# EAGLE board Stovetop-v3.0_Release (EAGLE 9.5.2), part 1 of 2
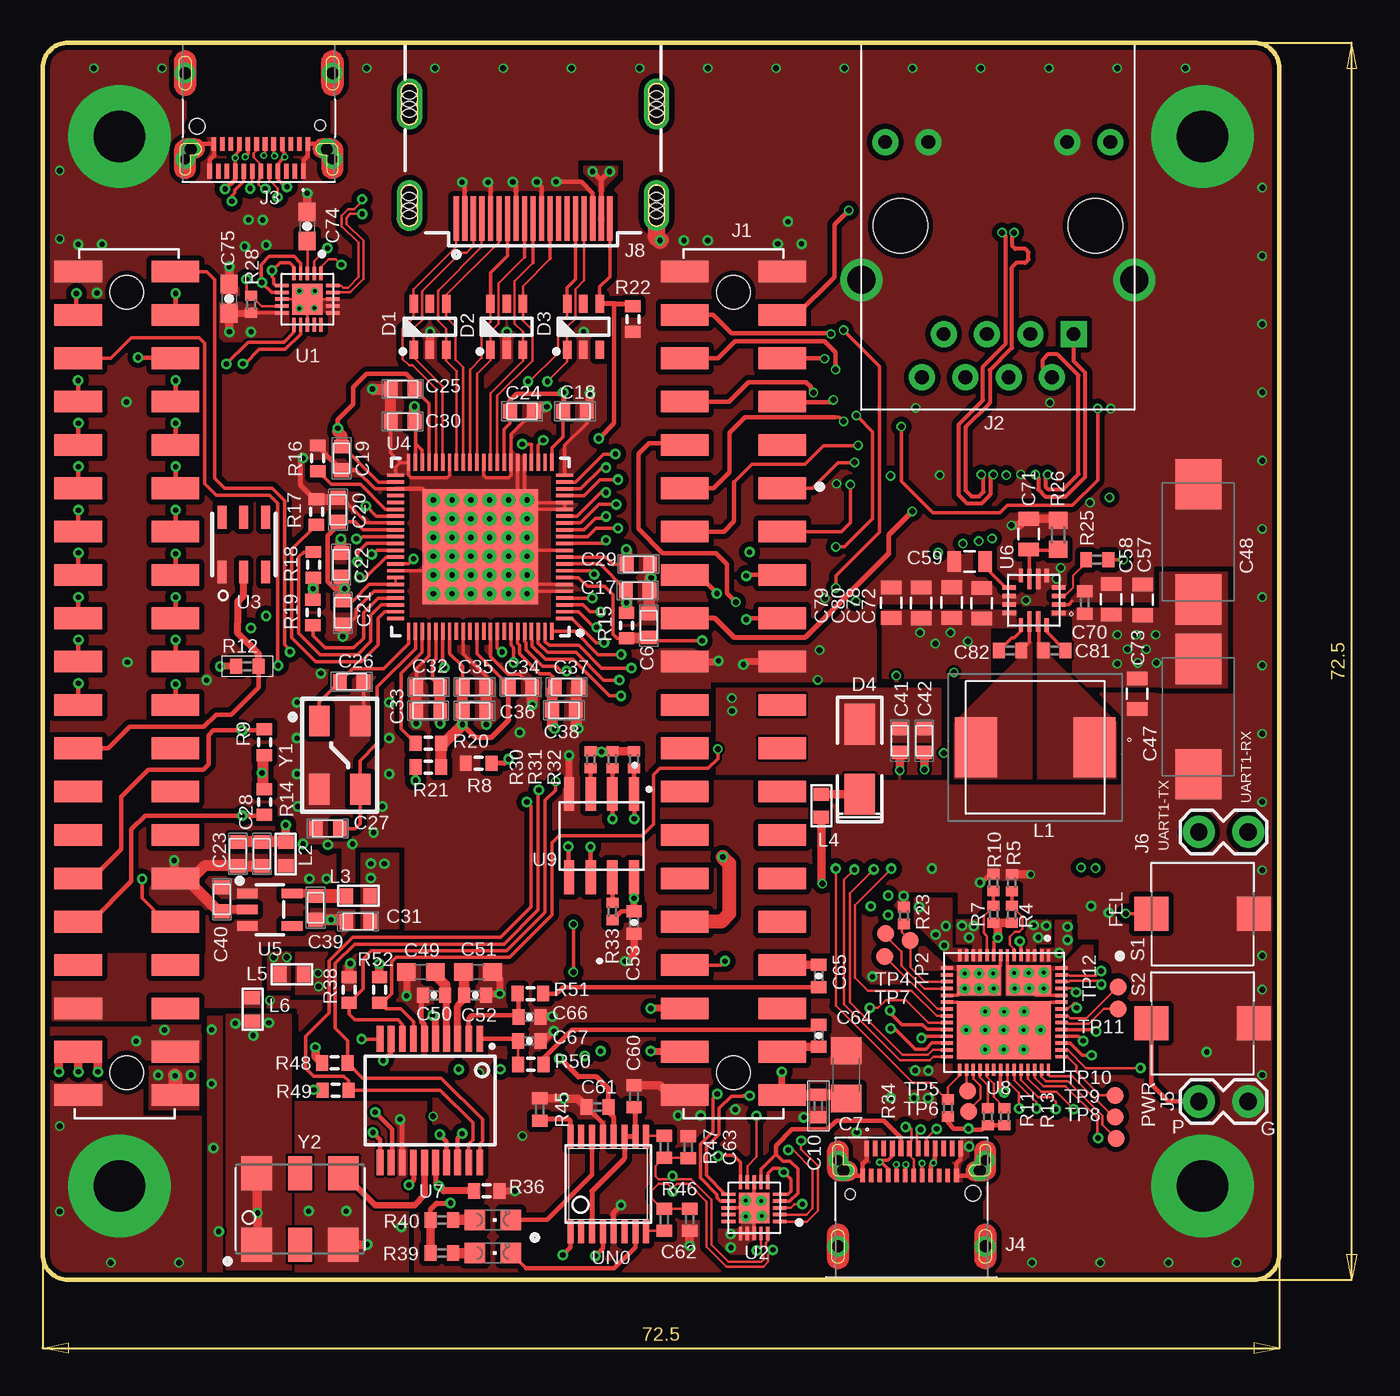
[diagram p10: board, top side]
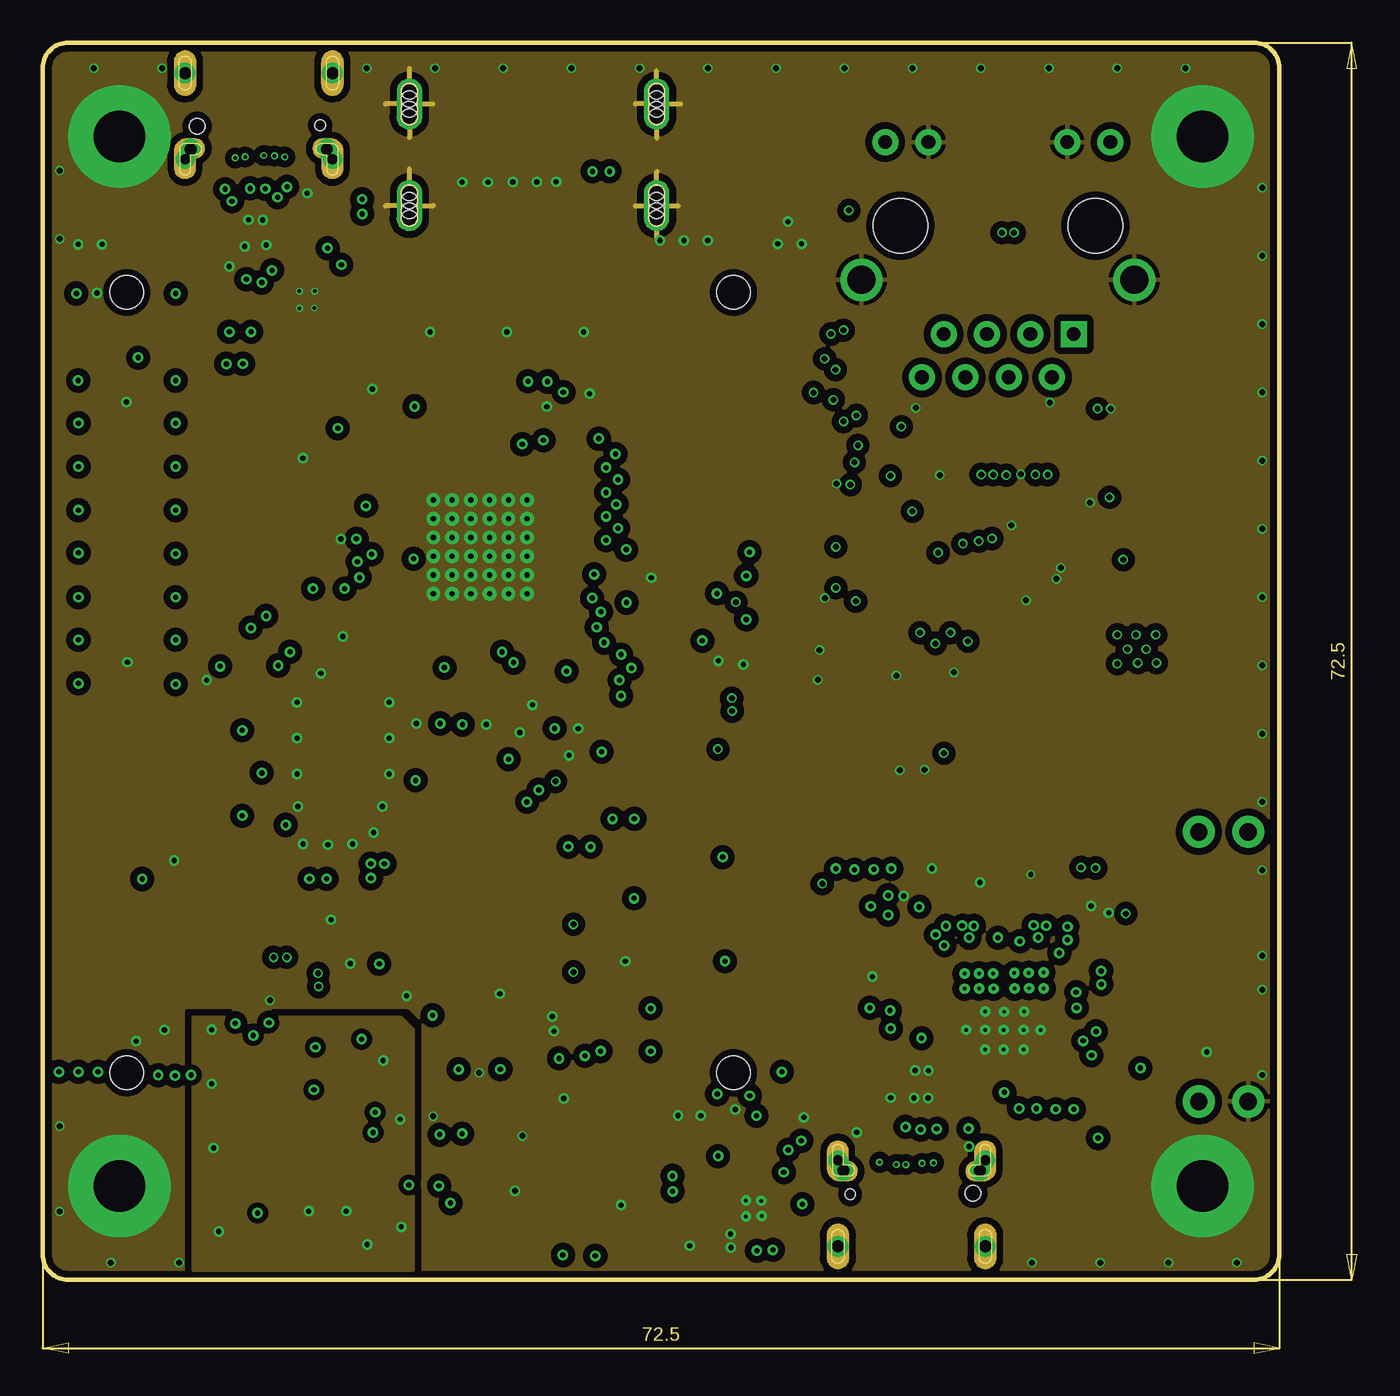
[diagram p11: board, inner layer GND]
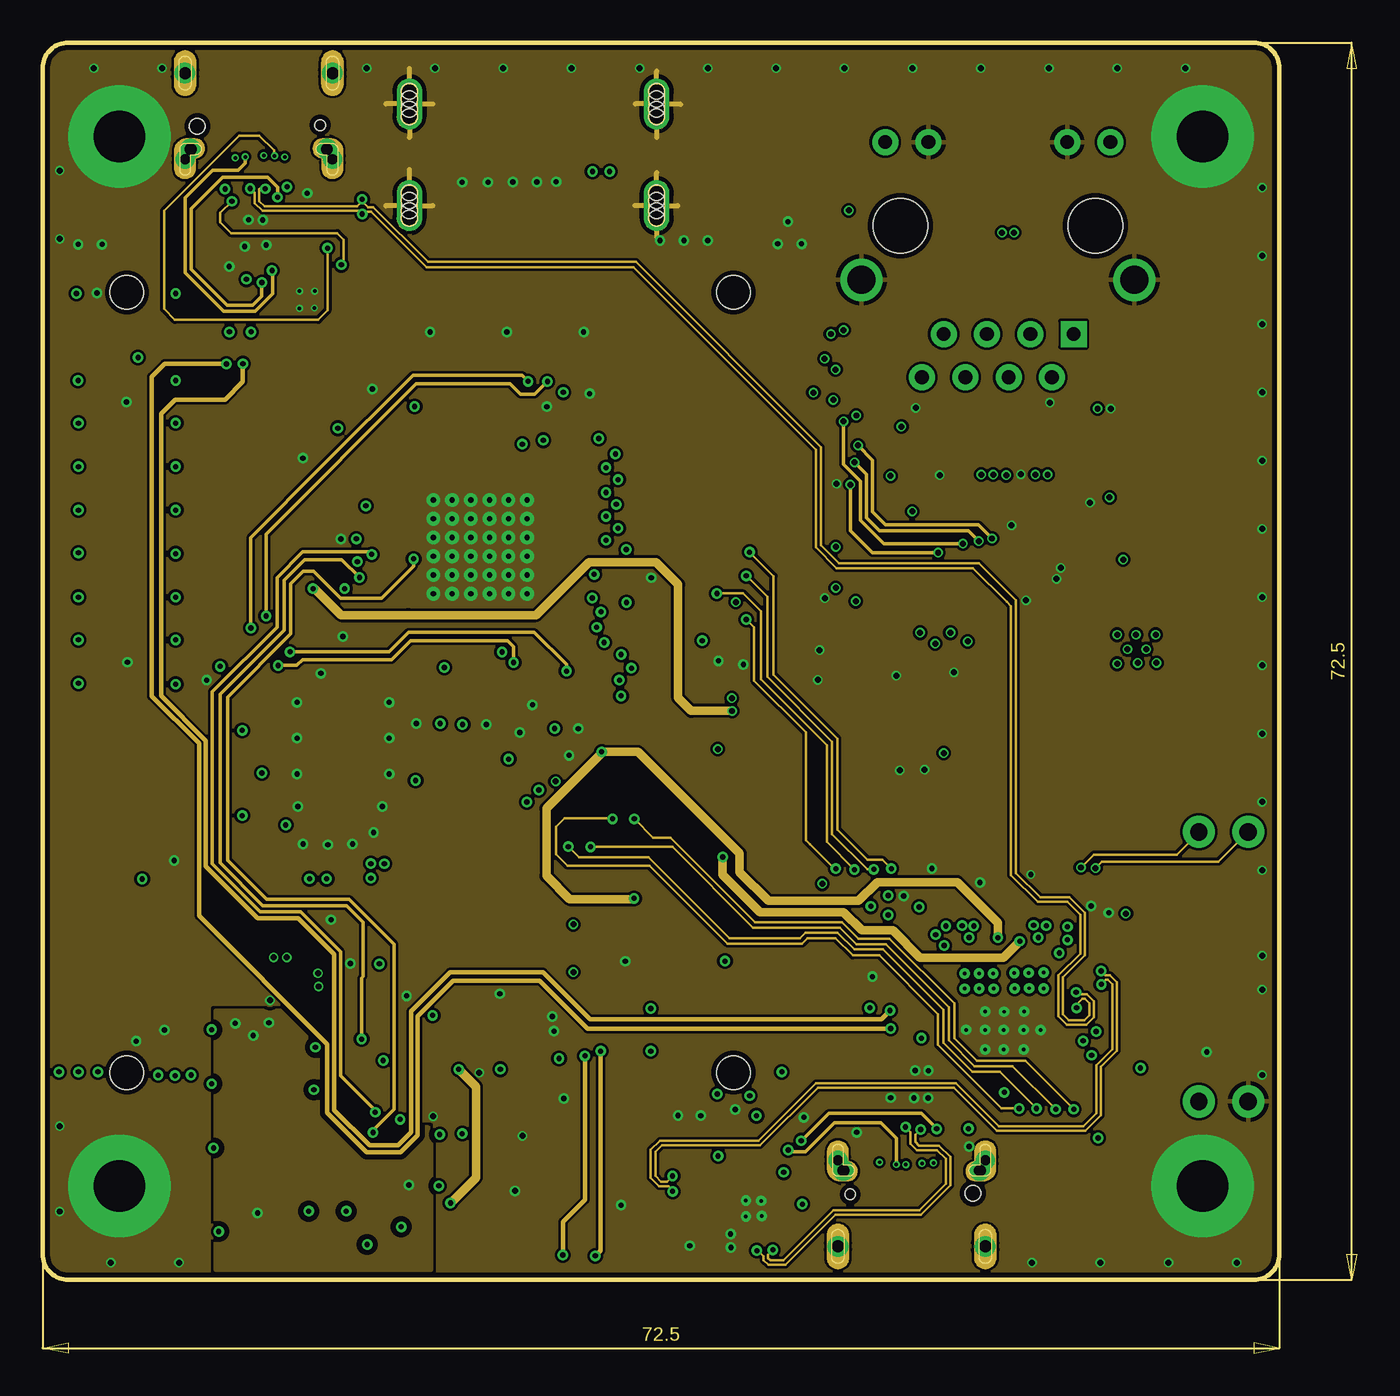
[diagram p12: board, inner layer SIG1]
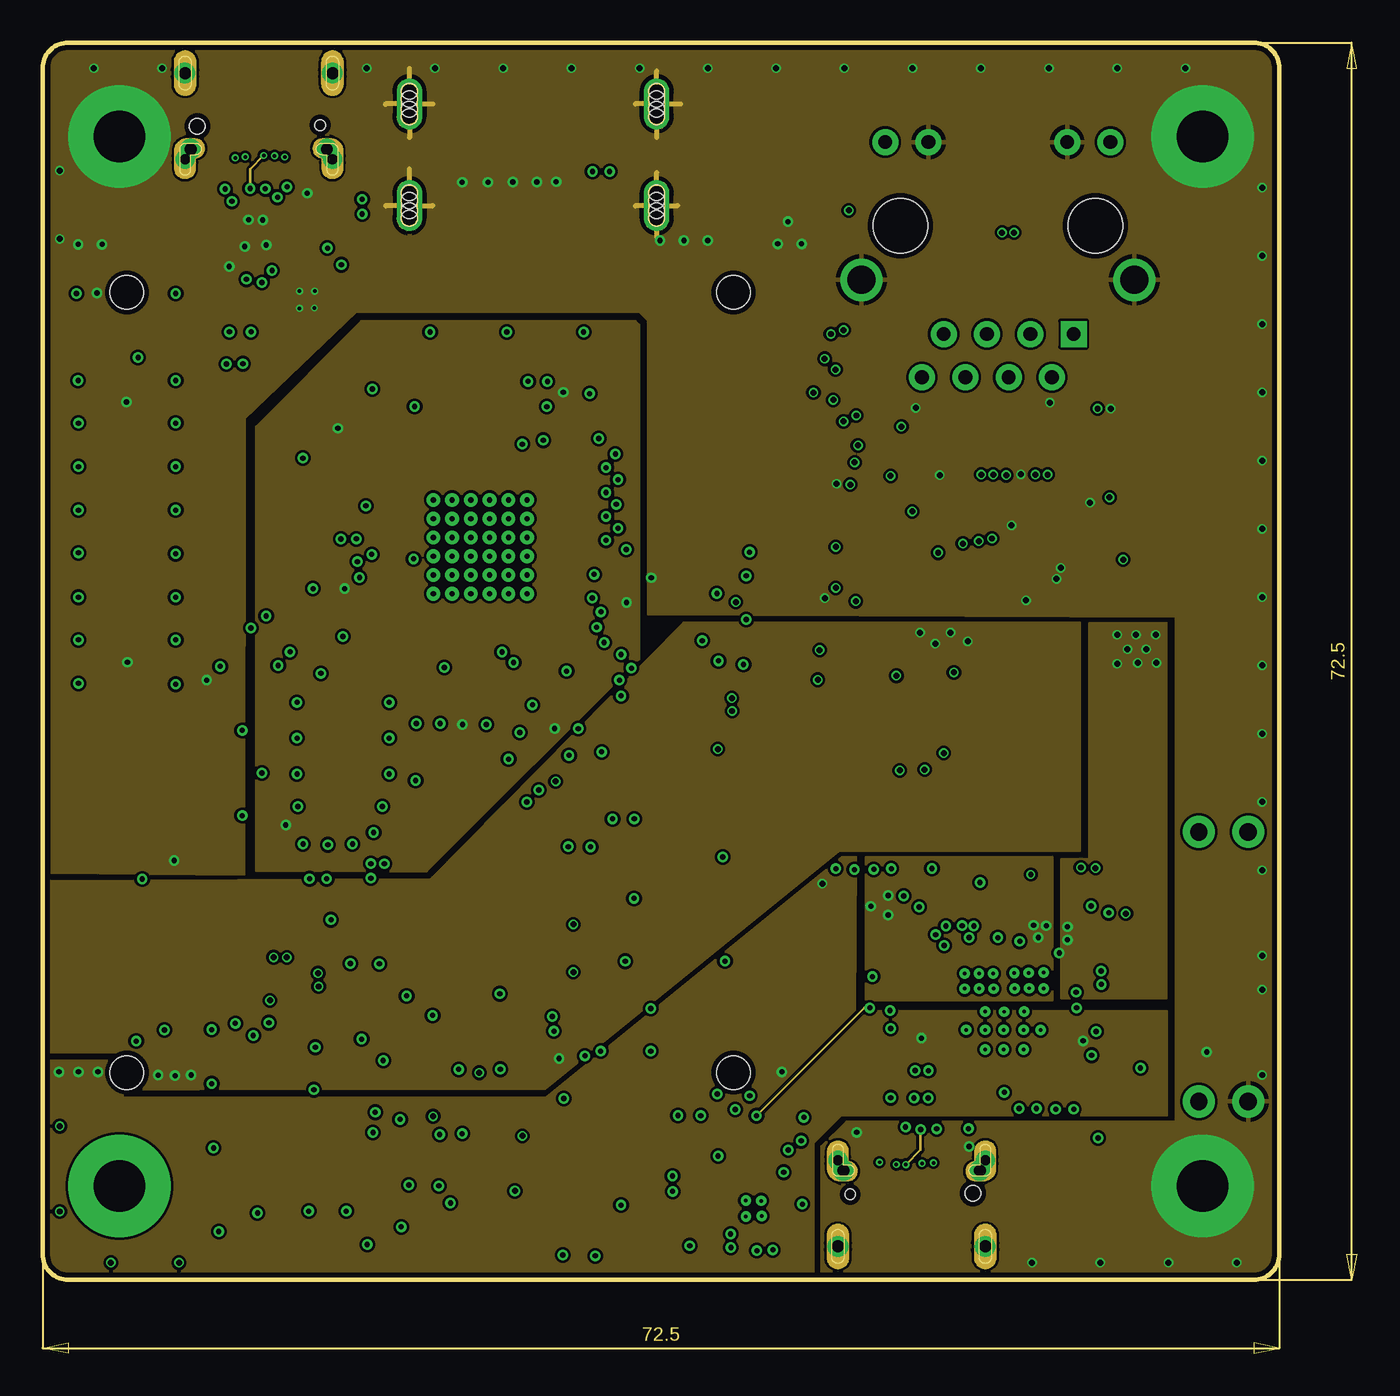
[diagram p13: board, inner layer SIG2]
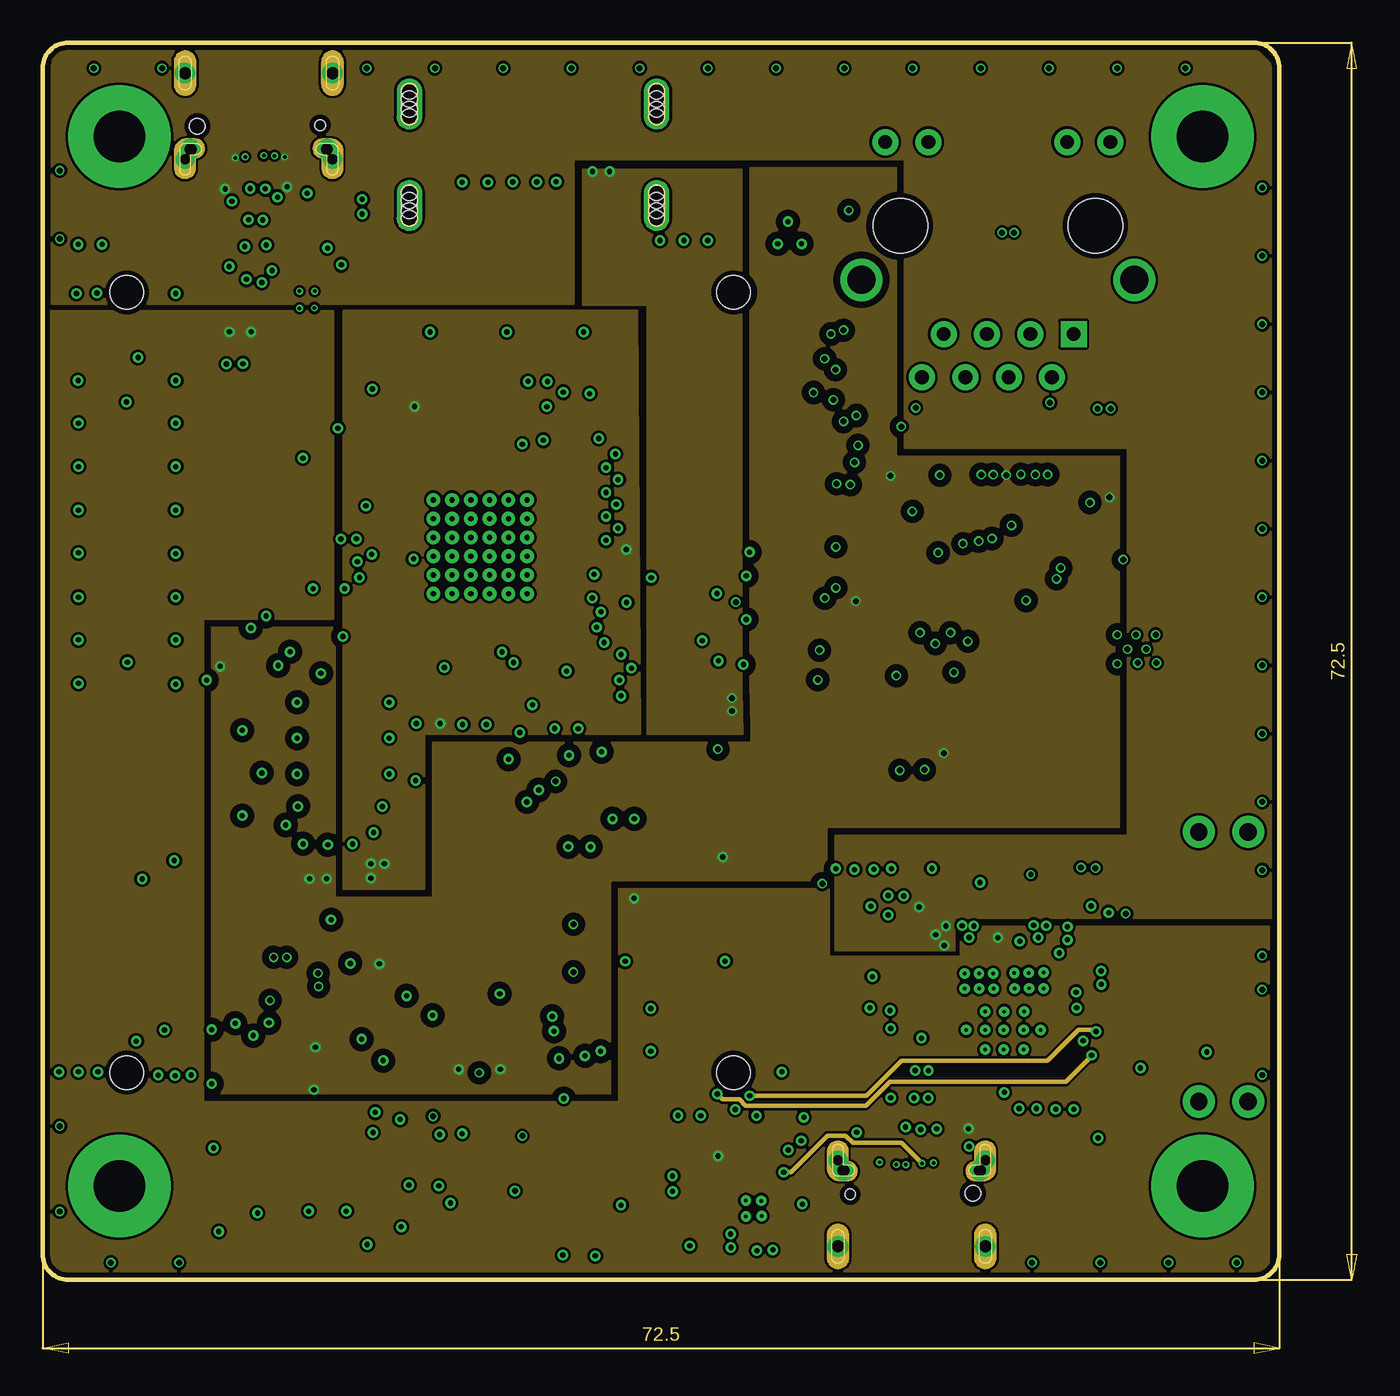
[diagram p14: board, inner layer PWR]
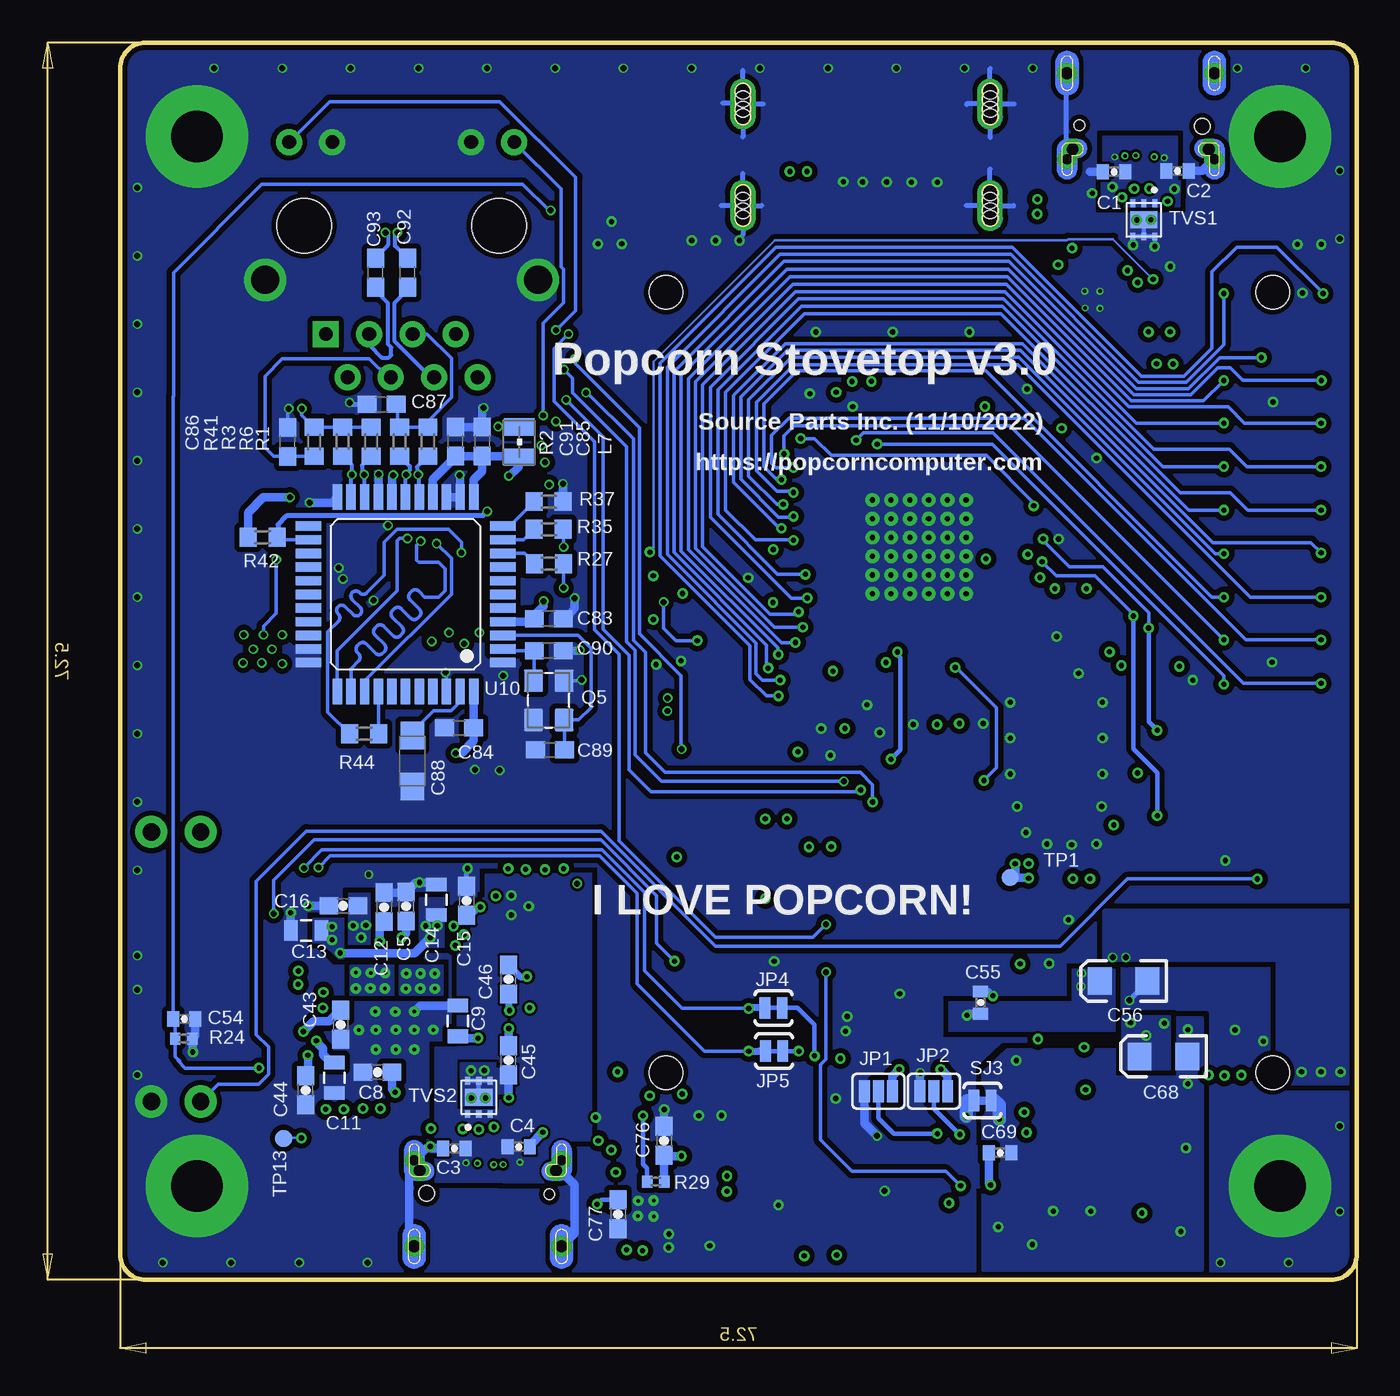
[diagram p15: board, bottom side, seen from below]

Size 72.5 x 72.5 mm. Coordinates in mm from the lower left corner, seen from the top.
Outline: 71,72.5 1.5,72.5 arc90 0,71 0,1.5 arc90 1.5,0 71,0 arc90 72.5,1.5 72.5,71 arc90 71,72.5
Copper layers (1+2*3+14*15+16): Top 0.035mm / dielectric 0.2mm / GND 0.035mm / dielectric 0.2mm / SIG1 0.035mm / dielectric 0.2mm / SIG2 0.035mm / dielectric 0.15mm / PWR 0.035mm / dielectric 0.2mm / Bottom 0.035mm
Design rules "Stovetop *": minimum track width 5mil, minimum drill 8mil, track to track 6mil, track to pad 6mil, pad to pad 8mil, via to via 6mil, smd to smd 6mil, copper to edge 12mil, drill to drill 10mil, minimum pad ring 10mil, minimum via ring 4mil, stop-mask expansion 4mil, vias tented up to drill 24mil, thermal gap 10mil
Net classes: 2 diff: width 0.14 mm; 3 SPI DIFF: width 0.241 mm, clearance 0.152 mm

## Footprints (pad centres in the part's own frame; a part is rotated, then mirrored left to right if it is on the bottom)
0402-CAP = smd 0.7 x 0.9: 1 -0.65,0; 2 0.65,0
0603-CAP = smd 1.1 x 1: 1 -0.85,0; 2 0.85,0
1608_0603 = smd 0.8 x 0.9: 1 -0.7,0; 2 0.7,0
C1206 = smd 1.6 x 1.8: 1 -1.4,0; 2 1.4,0
0805 = smd 0.8 x 1.2: 1 -0.9,0; 2 0.9,0
C0402 = smd 0.7 x 0.9: 1 -0.65,0; 2 0.65,0
D/7343-31W = smd 2.95 x 2.7: + 3.375,0; - -3.375,0
0603 = smd 1.1 x 1: 1 -0.85,0; 2 0.85,0
EIA3216 = smd 1.4 x 1.6: A 1.4,0; C -1.4,0
C0603 = smd 1.1 x 1: 1 -0.85,0; 2 0.85,0
SMC_A = smd 1.6 x 1.4: + -1.5,0; - 1.5,0
T_SOT95P285X90-6N = smd 1.05 x 0.5: 1 0,0; 2 0,-0.95; 3 0,-1.9; 4 2.7,-1.9; 5 2.7,-0.95; 6 2.7,0
SMA = smd 2.4 x 1.8: 1 -2.05,0; 2 2.05,0
POCKETCHIP-V1.0_98401-801-40LF = smd 1.27 x 2.79: 1 -24.175,-2.855; 2 -24.175,2.855; 3 -21.635,-2.855; 4 -21.635,2.855; 5 -19.095,-2.855; 6 -19.095,2.855; 7 -16.555,-2.855; 8 -16.555,2.855; 9 -14.015,-2.855; 10 -14.015,2.855; 11 -11.475,-2.855; 12 -11.475,2.855; 13 -8.935,-2.855; 14 -8.935,2.855; 15 -6.395,-2.855; 16 -6.395,2.855; 17 -3.855,-2.855; 18 -3.855,2.855; 19 -1.315,-2.855; 20 -1.315,2.855; 21 1.225,-2.855; 22 1.225,2.855; 23 3.765,-2.855; 24 3.765,2.855; 25 6.305,-2.855; 26 6.305,2.855; 27 8.845,-2.855; 28 8.845,2.855; 29 11.385,-2.855; 30 11.385,2.855; 31 13.925,-2.855; 32 13.925,2.855; 33 16.465,-2.855; 34 16.465,2.855; 35 19.005,-2.855; 36 19.005,2.855; 37 21.545,-2.855; 38 21.545,2.855; 39 24.085,-2.855; 40 24.085,2.855; 41 -24.175,32.705; 42 -24.175,38.415; 43 -21.635,32.705; 44 -21.635,38.415; 45 -19.095,32.705; 46 -19.095,38.415; 47 -16.555,32.705; 48 -16.555,38.415; 49 -14.015,32.705; 50 -14.015,38.415; 51 -11.475,32.705; 52 -11.475,38.415; 53 -8.935,32.705; 54 -8.935,38.415; 55 -6.395,32.705; 56 -6.395,38.415; 57 -3.855,32.705; 58 -3.855,38.415; 59 -1.315,32.705; 60 -1.315,38.415; 61 1.225,32.705; 62 1.225,38.415; 63 3.765,32.705; 64 3.765,38.415; 65 6.305,32.705; 66 6.305,38.415; 67 8.845,32.705; 68 8.845,38.415; 69 11.385,32.705; 70 11.385,38.415; 71 13.925,32.705; 72 13.925,38.415; 73 16.465,32.705; 74 16.465,38.415; 75 19.005,32.705; 76 19.005,38.415; 77 21.545,32.705; 78 21.545,38.415; 79 24.085,32.705; 80 24.085,38.415 | hole 1.95: 22.86,0; -22.86,0; -22.86,35.56; 22.86,35.56
HR911105A = drill 0.813 pad 1.524 square: 1 4.445,-6.35 | drill 0.813 pad 1.524: 2 3.175,-8.89; 3 1.905,-6.35; 4 0.635,-8.89; 5 -0.635,-6.35; 6 -1.905,-8.89; 7 -3.175,-6.35; 8 -4.445,-8.89; 9 6.604,4.902; 10 4.064,4.902; 11 -4.064,4.902; 12 -6.604,4.902 | drill 1.651 pad 2.159: 13 8.001,-3.175; 14 -8.001,-3.175 | hole 3.2: 5.715,0; -5.715,0
STOVETOP-V2.0_03062020_1600_STOVETOP-V2.0_CHECK_TRISTAN-ROBITAILLE'S-LIBRARY_DX07S0224JJ2_USB-C = smd 0.27 x 0.9: A1 0.975,2.7; A2 1.475,2.7; A3 1.975,2.7; A4 2.475,2.7; A5 2.975,2.7; A6 3.475,2.7; A7 3.975,2.7; A8 4.475,2.7; A9 4.975,2.7; A10 5.475,2.7; A11 5.975,2.7; A12 6.475,2.7 | smd 0.27 x 0.8: B1 6.225,1.1; B2 5.725,1.1; B3 5.225,1.1; B4 4.725,1.1; B5 4.225,1.1; B6 3.725,1.1; B7 3.225,1.1; B8 2.725,1.1; B9 2.225,1.1; B10 1.725,1.1; B11 1.225,1.1; B12 0.725,1.1 | drill 0.6 pad 1: SHIELD0 -0.72,2; SHIELD1 7.92,2 | drill 0.7 pad 1: SHIELD2 7.92,-3.05; SHIELD3 -0.72,-3.05; SHIELD4 -0.395,1.4; SHIELD5 7.595,1.4 | hole 0.9: 7.2,0.065 | hole 0.6: 0,0
1X02_LOCK = drill 1.016 pad 1.88: 1 -0.178,0; 2 2.718,0
CHIP_HDMI_T_MOLEX_45171 = smd 0.3 x 2.6: 1 4.5,10.31; 2 4,10.31; 3 3.5,10.31; 4 3,10.31; 5 2.5,10.31; 6 2,10.31; 7 1.5,10.31; 8 1,10.31; 9 0.5,10.31; 10 0,10.31; 11 -0.5,10.31; 12 -1,10.31; 13 -1.5,10.31; 14 -2,10.31; 15 -2.5,10.31; 16 -3,10.31; 17 -3.5,10.31; 18 -4,10.31; 19 -4.5,10.31 | drill 0.9 pad 1.499 long: 20 -7.25,3.59; 21 7.25,3.59; 22 7.25,9.55; 23 -7.25,9.55 | hole 0.9: -7.25,10.3; -7.25,8.8; -7.25,9.85; -7.25,9.25; -7.25,4.35; -7.25,2.85; -7.25,3.9; -7.25,3.3; 7.25,10.3; 7.25,8.8; 7.25,9.85; 7.25,9.25; 7.25,4.35; 7.25,3.9; 7.25,2.85; 7.25,3.3
SMT-JUMPER_3_1-NC_PASTE_SILK = smd 0.635 x 1.27: 1 -0.813,0; 2 0,0; 3 0.813,0
PAD-JUMPER-2-NC_BY_TRACE_YES_SILK = smd 0.635 x 1.27: 1 -0.508,0; 2 0.508,0
IND_4.7UH = smd 2.45 x 3.5: 1 -3.475,0; 2 3.475,0
0603' = smd 0.762 x 0.914: 1 -0.686,0; 2 0.686,0
WE-KI_0805_B = smd 1.02 x 1.78: 1 -0.89,0; 2 0.89,0
CRISTALLI_CRYSTAL3.2X2.5 = smd 1.3 x 1.1: 1 -1.15,-0.9; 2 1.15,-0.9; 3 1.15,0.9; 4 -1.15,0.9
R0603 = smd 1 x 1.1: 1 -0.85,0; 2 0.85,0
R0402 = smd 0.6 x 0.7: 1 -0.5,0; 2 0.5,0
J1-0603 = smd 0.7 x 0.9: 1 -0.75,0; 2 0.75,0
R0402' = smd 0.7 x 0.9: 1 -0.65,0; 2 0.65,0
LED-805 = smd 1.2 x 1.2: A 0,-1.05; C 0,1.05
1TS009A = smd 2 x 2: 1 -3,0; 2 3,0
SPARKFUN_SJ_2S-TRACE = smd 0.635 x 1.27: 1 -0.508,0; 2 0.508,0
CHIP_HDMI_TP-1MMX1MM = smd 1 x 1: 0 0,0
TP-1MMX1MM = smd 1 x 1: 0 0,0
TVS2200 = smd 0.45 x 0.3: 1 -0.975,0.65; 2 -0.975,0; 3 -0.975,-0.65; 4 0.975,-0.65; 5 0.975,0; 6 0.975,0.65 | smd 1 x 1.6: 7 0,0
TPD6S300 = smd 0.2 x 0.8: 1 -0.8,-1.5; 2 -0.4,-1.5; 3 0,-1.5; 4 0.4,-1.5; 5 0.8,-1.5; 11 0.8,1.5; 12 0.4,1.5; 13 0,1.5; 14 -0.4,1.5; 15 -0.8,1.5 | smd 0.8 x 0.2: 6 1.5,-0.8; 7 1.5,-0.4; 8 1.5,0; 9 1.5,0.4; 10 1.5,0.8; 16 -1.5,0.8; 17 -1.5,0.4; 18 -1.5,0; 19 -1.5,-0.4; 20 -1.5,-0.8 | smd 1.8 x 1.8: 21 0,0
TSOC6 = smd 0.53 x 1.33: 1 -1.27,-1.6; 2 0,-1.6; 3 1.27,-1.6; 4 1.27,1.6; 5 0,1.6; 6 -1.27,1.6
QFN40P1000X1000X90_HS-89M = smd 1 x 0.2: 1 -4.95,4.2; 2 -4.95,3.8; 3 -4.95,3.4; 4 -4.95,3; 5 -4.95,2.6; 6 -4.95,2.2; 7 -4.95,1.8; 8 -4.95,1.4; 9 -4.95,1; 10 -4.95,0.6; 11 -4.95,0.2; 12 -4.95,-0.2; 13 -4.95,-0.6; 14 -4.95,-1; 15 -4.95,-1.4; 16 -4.95,-1.8; 17 -4.95,-2.2; 18 -4.95,-2.6; 19 -4.95,-3; 20 -4.95,-3.4; 21 -4.95,-3.8; 22 -4.95,-4.2; 45 4.95,-4.2; 46 4.95,-3.8; 47 4.95,-3.4; 48 4.95,-3; 49 4.95,-2.6; 50 4.95,-2.2; 51 4.95,-1.8; 52 4.95,-1.4; 53 4.95,-1; 54 4.95,-0.6; 55 4.95,-0.2; 56 4.95,0.2; 57 4.95,0.6; 58 4.95,1; 59 4.95,1.4; 60 4.95,1.8; 61 4.95,2.2; 62 4.95,2.6; 63 4.95,3; 64 4.95,3.4; 65 4.95,3.8; 66 4.95,4.2 | smd 0.2 x 1: 23 -4.2,-4.95; 24 -3.8,-4.95; 25 -3.4,-4.95; 26 -3,-4.95; 27 -2.6,-4.95; 28 -2.2,-4.95; 29 -1.8,-4.95; 30 -1.4,-4.95; 31 -1,-4.95; 32 -0.6,-4.95; 33 -0.2,-4.95; 34 0.2,-4.95; 35 0.6,-4.95; 36 1,-4.95; 37 1.4,-4.95; 38 1.8,-4.95; 39 2.2,-4.95; 40 2.6,-4.95; 41 3,-4.95; 42 3.4,-4.95; 43 3.8,-4.95; 44 4.2,-4.95; 67 4.2,4.95; 68 3.8,4.95; 69 3.4,4.95; 70 3,4.95; 71 2.6,4.95; 72 2.2,4.95; 73 1.8,4.95; 74 1.4,4.95; 75 1,4.95; 76 0.6,4.95; 77 0.2,4.95; 78 -0.2,4.95; 79 -0.6,4.95; 80 -1,4.95; 81 -1.4,4.95; 82 -1.8,4.95; 83 -2.2,4.95; 84 -2.6,4.95; 85 -3,4.95; 86 -3.4,4.95; 87 -3.8,4.95; 88 -4.2,4.95 | smd 6.75 x 6.75: 89 0,0 | drill 0.3 pad 0.61: P$1 -2.75,2.75; P$2 2.75,2.75; P$3 -2.75,-2.75; P$4 2.75,-2.75; P$5 -1.65,2.75; P$6 -0.55,2.75; P$7 1.65,2.75; P$8 0.55,2.75; P$9 -1.65,-2.75; P$10 -0.55,-2.75; P$11 1.65,-2.75; P$12 0.55,-2.75; P$13 -2.75,1.65; P$14 -2.75,0.55; P$15 -2.75,-0.55; P$16 -2.75,-1.65; P$17 2.75,1.65; P$18 2.75,0.55; P$19 2.75,-0.55; P$20 2.75,-1.65; P$21 -1.65,1.65; P$22 -0.55,1.65; P$23 0.55,1.65; P$24 1.65,1.65; P$25 -1.65,0.55; P$26 -0.55,0.55; P$27 0.55,0.55; P$28 1.65,0.55; P$29 -1.65,-0.55; P$30 -0.55,-0.55; P$31 0.55,-0.55; P$32 1.65,-0.55; P$33 1.65,-1.65; P$34 0.55,-1.65; P$35 -0.55,-1.65; P$36 -1.65,-1.65
SOT23-5 = smd 0.559 x 1.219: 1 -0.95,-1.3; 2 0,-1.3; 3 0.965,-1.3; 4 0.965,1.321; 5 -0.95,1.321
MP28167GQ = smd 0.8 x 0.25: 1 -1.45,0.75; 2 -1.45,0.25; 3 -1.45,-0.25; 4 -1.45,-0.75; 9 1.45,-0.75; 10 1.45,-0.25; 11 1.45,0.25; 12 1.45,0.75 | smd 0.25 x 0.8: 5 -0.75,-1.45; 8 0.75,-1.45; 13 0.75,1.45; 16 -0.75,1.45 | smd 0.25 x 1.2: 6 -0.25,-1.25; 7 0.25,-1.25; 14 0.25,1.25; 15 -0.25,1.25
SSOP20 = smd 0.4 x 1.5: 1 -2.925,-3.625; 2 -2.275,-3.625; 3 -1.625,-3.625; 4 -0.975,-3.625; 5 -0.325,-3.625; 6 0.325,-3.625; 7 0.975,-3.625; 8 1.625,-3.625; 9 2.275,-3.625; 10 2.925,-3.625; 11 2.925,3.625; 12 2.275,3.625; 13 1.625,3.625; 14 0.975,3.625; 15 0.325,3.625; 16 -0.325,3.625; 17 -0.975,3.625; 18 -1.625,3.625; 19 -2.275,3.625; 20 -2.925,3.625
TPS65988 = smd 0.7 x 0.2: 1 -3.35,2.6; 2 -3.35,2.2; 3 -3.35,1.8; 4 -3.35,1.4; 5 -3.35,1; 6 -3.35,0.6; 7 -3.35,0.2; 8 -3.35,-0.2; 9 -3.35,-0.6; 10 -3.35,-1; 11 -3.35,-1.4; 12 -3.35,-1.8; 13 -3.35,-2.2; 14 -3.35,-2.6; 29 3.35,-2.6; 30 3.35,-2.2; 31 3.35,-1.8; 32 3.35,-1.4; 33 3.35,-1; 34 3.35,-0.6; 35 3.35,-0.2; 36 3.35,0.2; 37 3.35,0.6; 38 3.35,1; 39 3.35,1.4; 40 3.35,1.8; 41 3.35,2.2; 42 3.35,2.6 | smd 0.2 x 0.7: 15 -2.6,-3.35; 16 -2.2,-3.35; 17 -1.8,-3.35; 18 -1.4,-3.35; 19 -1,-3.35; 20 -0.6,-3.35; 21 -0.2,-3.35; 22 0.2,-3.35; 23 0.6,-3.35; 24 1,-3.35; 25 1.4,-3.35; 26 1.8,-3.35; 27 2.2,-3.35; 28 2.6,-3.35; 43 2.6,3.35; 44 2.2,3.35; 45 1.8,3.35; 46 1.4,3.35; 47 1,3.35; 48 0.6,3.35; 49 0.2,3.35; 50 -0.2,3.35; 51 -0.6,3.35; 52 -1,3.35; 53 -1.4,3.35; 54 -1.8,3.35; 55 -2.2,3.35; 56 -2.6,3.35 | smd 1.75 x 2.6: 57 -1.875,1.45 | smd 1.75 x 2.55: 58 -1.875,-1.475 | smd 3.4 x 5.5: 59 1.05,0
W25X05CLSNIG = smd 1.97 x 0.6: 1 -2.475,1.905; 2 -2.475,0.635; 3 -2.475,-0.635; 4 -2.475,-1.905; 5 2.41,-1.905; 6 2.41,-0.635; 7 2.41,0.635; 8 2.41,1.905
TQFP44 = smd 0.55 x 1.5: P1 -4,-5.7; P2 -3.2,-5.7; P3 -2.4,-5.7; P4 -1.6,-5.7; P5 -0.8,-5.7; P6 0,-5.7; P7 0.8,-5.7; P8 1.6,-5.7; P9 2.4,-5.7; P10 3.2,-5.7; P11 4,-5.7; P23 4,5.7; P24 3.2,5.7; P25 2.4,5.7; P26 1.6,5.7; P27 0.8,5.7; P28 0,5.7; P29 -0.8,5.7; P30 -1.6,5.7; P31 -2.4,5.7; P32 -3.2,5.7; P33 -4,5.7 | smd 1.5 x 0.55: P12 5.7,-4; P13 5.7,-3.2; P14 5.7,-2.4; P15 5.7,-1.6; P16 5.7,-0.8; P17 5.7,0; P18 5.7,0.8; P19 5.7,1.6; P20 5.7,2.4; P21 5.7,3.2; P22 5.7,4; P34 -5.7,4; P35 -5.7,3.2; P36 -5.7,2.4; P37 -5.7,1.6; P38 -5.7,0.8; P39 -5.7,0; P40 -5.7,-0.8; P41 -5.7,-1.6; P42 -5.7,-2.4; P43 -5.7,-3.2; P44 -5.7,-4
SSOP-16 = smd 0.35 x 1.4: 1 -2.223,-2.775; 2 -1.587,-2.775; 3 -0.953,-2.775; 4 -0.318,-2.775; 5 0.318,-2.775; 6 0.953,-2.775; 7 1.587,-2.775; 8 2.223,-2.775; 9 2.223,2.775; 10 1.587,2.775; 11 0.953,2.775; 12 0.318,2.775; 13 -0.318,2.775; 14 -0.953,2.775; 15 -1.587,2.775; 16 -2.223,2.775
ABM3B = smd 1.8 x 1.2: 1 -2,-1.2; 2 2,-1.2; 3 2,1.2; 4 -2,1.2
CRYSTAL-SMD-7.5X5.2-6PIN = smd 1.8 x 2: 1 -2.54,-2.1; 2 2.54,-2.1; 3 2.54,2.1; 4 -2.54,2.1 | smd 1.4 x 2: NC0 0,-2.1; NC1 0,2.1

## Placement (x,y rotation side)
C1  10NF/35V  [0402-CAP]  14.23,64.93 0 bottom
C2  10NF/35V  [0402-CAP]  10.51,64.99 180 bottom
C3  10NF/35V  [0402-CAP]  52.91,7.7 0 bottom
C4  10NF/35V  [0402-CAP]  49.14,7.79 180 bottom
C5  10uF  [0603-CAP]  55.74,21.88 270 bottom
C6  100nF  [1608_0603]  35.53,38.34 270 top
C7  22uF  [C1206]  47.11,12.02 90 top
C8  10uF  [0603-CAP]  57.42,12.17 0 bottom
C9  22uF  [0805]  52.7,15.17 270 bottom
C10  100nF  [C0402]  45.47,10.19 270 top
C11  22uF  [0805]  59.95,11.84 90 bottom
C12  10uF  [0603-CAP]  57.03,21.84 270 bottom
C13  22uF  [0805]  61.6,20.47 0 bottom
C14  22uF  [0805]  53.98,22.27 270 bottom
C15  1uF  [0603-CAP]  52.19,22.21 90 bottom
C16  1uF  [0603-CAP]  59.42,21.92 180 bottom
C17  100nF  [1608_0603]  34.88,40.39 0 top
C18  100nF  [1608_0603]  31.21,50.9 0 top
C19  100nF  [1608_0603]  17.53,48.14 270 top
C20  100nF  [1608_0603]  17.32,45.13 90 top
C21  100nF  [1608_0603]  17.61,39.1 270 top
C22  100nF  [1608_0603]  17.51,41.9 90 top
C23  10uF  [1608_0603]  11.45,24.96 270 top
C24  100nF  [1608_0603]  28.11,50.9 0 top
C25  100nF  [1608_0603]  21.11,52.2 180 top
C26  18pF  [1608_0603]  18.12,35.04 180 top
C27  18pF  [1608_0603]  16.72,26.44 0 top
C28  10uF  [1608_0603]  12.85,24.96 270 top
C29  100nF  [1608_0603]  34.93,41.94 0 top
C30  100nF  [1608_0603]  21.11,50.3 180 top
C31  10uF  [1608_0603]  18.51,21 180 top
C32  100nF  [1608_0603]  22.62,34.74 180 top
C33  10uF  [1608_0603]  22.61,33.34 180 top
C34  100nF  [1608_0603]  28.02,34.74 0 top
C35  100nF  [1608_0603]  25.32,34.74 0 top
C36  10uF  [1608_0603]  25.32,33.34 0 top
C37  100nF  [1608_0603]  30.72,34.74 0 top
C38  10uF  [1608_0603]  30.57,33.38 0 top
C39  4.7uF  [1608_0603]  16.01,21.8 270 top
C40  4.7uF  [1608_0603]  10.51,22.3 270 top
C41  100nF  [1608_0603]  50.24,31.6 270 top
C42  10uF  [1608_0603]  51.68,31.6 270 top
C43  220pF  [0603-CAP]  59.57,14.95 90 bottom
C44  220pF  [0603-CAP]  61.64,11.11 90 bottom
C45  220pF  [0603-CAP]  49.73,12.87 90 bottom
C46  220pF  [0603-CAP]  49.74,17.6 270 bottom
C47  47uF  [D/7343-31W]  67.75,33 90 top
C48  47uF  [D/7343-31W]  67.75,43.25 270 top
C49  10uF  [0603]  22.18,18.04 180 top
C50  0.1uF  [0402-CAP]  22.95,16.68 180 top
C51  10uF  [0603]  25.52,18.04 0 top
C52  0.1uF  [0402-CAP]  25.36,16.68 0 top
C53  0.1uF  [0402-CAP]  34.67,20.94 90 top
C54  0.1uF  [0402-CAP]  68.74,15.29 180 bottom
C55  0.01uF  [0402-CAP]  22.07,16.24 270 bottom
C56  10uF  [EIA3216]  13.68,17.51 180 bottom
C57  22uF  [0805]  64.48,39.85 270 top
C58  22uF  [0805]  62.63,39.88 270 top
C59  1uF  [0805]  54.35,42.1 0 top
C60  0.1uF  [C0402]  34.67,10.75 90 top
C61  10uF  [C0402]  32.53,10.12 180 top
C62  47pF  [C0402]  37.93,3.51 270 top
C63  47pF  [C0402]  37.85,7.77 90 top
C64  1uF  [0402-CAP]  45.5,14.3 90 top
C65  1uF  [0402-CAP]  45.5,17.8 270 top
C66  0.01uF  [0402-CAP]  28.55,15.39 180 top
C67  0.01uF  [0402-CAP]  28.53,14 180 top
C68  10uF  [EIA3216]  11.34,13.09 180 bottom
C69  0.1uF  [0402-CAP]  20.91,7.44 0 bottom
C70  100nF  [C0402]  61.09,39.69 90 top
C71  22nF  [0805]  57.8,43.7 270 top
C72  22uF  [0805]  55.06,39.65 270 top
C73  1uF  [0805]  64.17,34.34 90 top
C74  0.1uF/50V  [0603-CAP]  15.51,61.73 270 top
C75  10uF  [0603-CAP]  10.94,57.49 270 top
C76  10uF  [0603-CAP]  40.62,8.14 270 bottom
C77  0.1uF/50V  [0603-CAP]  43.31,3.84 90 bottom
C78  22uF  [0805]  53.28,39.69 270 top
C79  22uF  [0805]  49.76,39.67 270 top
C80  22uF  [0805]  51.51,39.67 270 top
C81  100nF  [C0402]  59.32,36.88 180 top
C82  100nF  [C0402]  56.71,36.88 0 top
C83  0.1uF  [C0603]  47.38,38.75 0 bottom
C84  0.1uF  [C0603]  52.63,32.34 180 bottom
C85  0.1uF  [C0603]  51.27,49.12 90 bottom
C86  0.01uF  [C0603]  62.68,49.1 90 bottom
C87  0.01uF  [C0603]  57.18,51.3 180 bottom
C88  10uF  [SMC_A]  55.37,30.4 270 bottom
C89  27pf  [C0603]  47.29,31.06 180 bottom
C90  27pf  [C0603]  47.38,36.87 0 bottom
C91  0.1uF  [C0603]  52.84,49.12 90 bottom
C92  6.8nF  [C0603]  55.66,59.01 270 bottom
C93  6.8nF  [C0603]  57.54,59.01 270 bottom
D1  D-SEMTECH-RCLAMP0504S  [T_SOT95P285X90-6N]  21.76,54.5 90 top
D2  D-SEMTECH-RCLAMP0504S  [T_SOT95P285X90-6N]  26.26,54.5 90 top
D3  D-SEMTECH-RCLAMP0504S  [T_SOT95P285X90-6N]  30.76,54.5 90 top
D4  B240A  [SMA]  47.89,30.5 90 top
DRILEGEND  [DRILEGEND]  -67.42,-12.21 0 top  (outside the outline)
J1  POCKETCHIP-V1.0_98401-801-40LF  [POCKETCHIP-V1.0_98401-801-40LF]  40.5,35 90 top
J2  HR911105A  [HR911105A]  56,61.77 0 top
J3  STOVETOP-V2.0_03062020_1600_STOVETOP-V2.0_CHECK_TRISTAN-ROBITAILLE'S-LIBRARY_DX07S024JJ2_USB_TYPE-C  [STOVETOP-V2.0_03062020_1600_STOVETOP-V2.0_CHECK_TRISTAN-ROBITAILLE'S-LIBRARY_DX07S0224JJ2_USB-C]  16.27,67.67 180 top
J4  STOVETOP-V2.0_03062020_1600_STOVETOP-V2.0_CHECK_TRISTAN-ROBITAILLE'S-LIBRARY_DX07S024JJ2_USB_TYPE-C  [STOVETOP-V2.0_03062020_1600_STOVETOP-V2.0_CHECK_TRISTAN-ROBITAILLE'S-LIBRARY_DX07S0224JJ2_USB-C]  47.34,5 0 top
J5  [1X02_LOCK]  70.5,10.45 180 top
J6  [1X02_LOCK]  70.5,26.25 180 top
J8  HDMI_T_MOLEX_45171  [CHIP_HDMI_T_MOLEX_45171]  28.75,72.5 180 top
JP1  JUMPER-SMT_3_1-NC_PASTE_SILK  [SMT-JUMPER_3_1-NC_PASTE_SILK]  28.05,11.05 180 bottom
JP2  JUMPER-SMT_3_1-NC_PASTE_SILK  [SMT-JUMPER_3_1-NC_PASTE_SILK]  24.8,11.05 0 bottom
JP4  JUMPER-PAD-2-NC_BY_TRACE  [PAD-JUMPER-2-NC_BY_TRACE_YES_SILK]  34.2,15.93 180 bottom
JP5  JUMPER-PAD-2-NC_BY_TRACE  [PAD-JUMPER-2-NC_BY_TRACE_YES_SILK]  34.17,13.41 180 bottom
L1  IND_4.7UH  [IND_4.7UH]  58.19,31.2 180 top
L2  ACML  [0603']  14.25,24.96 270 top
L3  ACML  [0603']  18.51,22.5 180 top
L4  ACML  [0603']  45.65,27.78 90 top
L5  ACML  [0603']  14.61,17.91 180 top
L6  ACML  [0603']  12.3,15.85 270 top
L7  [WE-KI_0805_B]  49.1,49.09 90 bottom
Q5  FTX25.000M12SM3S  [CRISTALLI_CRYSTAL3.2X2.5]  47.38,33.96 90 bottom
R1  49R9 1%  [R0603]  56.11,49.12 90 bottom
R2  49R9 1%  [R0603]  54.46,49.12 90 bottom
R3  49R9 1%  [R0603]  59.46,49.12 90 bottom
R4  19.1K  [R0402]  56.82,21.42 270 top
R5  10K  [R0402]  56.82,23.27 270 top
R6  49R9 1%  [R0603]  57.78,49.12 90 bottom
R7  28K  [R0402]  55.75,21.42 270 top
R8  1.2K  [J1-0603]  25.56,30.27 0 top
R9  6.7K  [J1-0603]  13.01,31.5 270 top
R10  10K  [R0402]  55.74,23.28 270 top
R11  10K  [R0402]  55.42,9.55 270 top
R12  4.7K  [R0402']  12.01,35.96 180 top
R13  10K  [R0402]  56.4,9.55 270 top
R14  6.7K  [J1-0603]  13.01,28 90 top
R15  1M  [J1-0603]  34.23,38.34 90 top
R16  10k  [J1-0603]  16.13,48.14 90 top
R17  10k  [J1-0603]  16.06,45 90 top
R18  10k  [J1-0603]  15.88,41.9 270 top
R19  10k  [J1-0603]  15.85,39.1 90 top
R20  10k  [J1-0603]  22.62,31.44 0 top
R21  10k  [J1-0603]  22.62,30.04 0 top
R22  47k  [J1-0603]  34.61,56.3 90 top
R23  1M  [R0402]  50.5,21.35 270 top
R24  10K  [R0402]  68.77,14.13 180 bottom
R25  330K  [R0402']  61.83,42.2 180 top
R26  20K  [R0603]  59.53,43.66 90 top
R27  1K1  [R0603]  47.35,41.96 0 bottom
R28  100K  [R0402]  12.22,57.17 270 top
R29  100K  [R0402]  41.1,5.76 0 bottom
R30  10K  [R0402]  32.13,30.48 90 top
R31  10K  [R0402]  33.4,30.48 90 top
R32  10K  [R0402]  34.67,30.48 90 top
R33  10K  [R0402]  33.4,21.59 270 top
R34  10K  [R0402]  53.07,10.06 270 top
R35  1K1  [R0603]  47.38,43.99 0 bottom
R36  100K  [J1-0603]  26.04,5.21 0 top
R37  12.4K 1%  [R0603]  47.38,45.6 0 bottom
R38  100K  [J1-0603]  17.97,16.99 270 top
R39  1K  [R0402']  23.4,1.56 0 top
R40  1K  [R0402']  23.4,3.51 0 top
R41  10R, 1/12W, 1%  [R0603]  61.13,49.1 270 bottom
R42  100K  [R0603]  64.15,43.51 0 bottom
R44  22R  [R0603]  58.21,32 180 bottom
R45  0  [R0402']  29.15,9.98 270 top
R46  27R  [R0402']  36.45,3.51 90 top
R47  27R  [R0402']  36.44,7.8 270 top
R48  100K  [J1-0603]  17.12,12.71 180 top
R49  100K  [J1-0603]  17.18,11.11 180 top
R50  100R  [J1-0603]  28.62,12.62 0 top
R51  100R  [J1-0603]  28.6,16.77 0 top
R52  100K  [J1-0603]  19.75,16.99 90 top
RX_LED  Blue  [LED-805]  26.4,1.56 270 top
S1  1TS009A  [1TS009A]  68,21.45 0 top
S2  1TS009A  [1TS009A]  68,15.03 0 top
SJ3  SPARKFUN_SOLDERJUMPERTRACE  [SPARKFUN_SJ_2S-TRACE]  21.95,10.5 0 bottom
TP1  CHIP_HDMI_TEST_POINT  [CHIP_HDMI_TP-1MMX1MM]  20.34,23.56 180 bottom
TP2  TEST_POINT  [TP-1MMX1MM]  50.87,19.88 0 top
TP4  TEST_POINT  [TP-1MMX1MM]  49.44,20.28 0 top
TP5  TEST_POINT  [TP-1MMX1MM]  54.24,11.07 0 top
TP6  TEST_POINT  [TP-1MMX1MM]  54.28,9.86 0 top
TP7  TEST_POINT  [TP-1MMX1MM]  49.38,18.94 0 top
TP8  TEST_POINT  [TP-1MMX1MM]  62.92,8.29 0 top
TP9  TEST_POINT  [TP-1MMX1MM]  62.88,9.54 0 top
TP10  TEST_POINT  [TP-1MMX1MM]  62.89,10.8 0 top
TP11  TEST_POINT  [TP-1MMX1MM]  63.05,15.88 0 top
TP12  TEST_POINT  [TP-1MMX1MM]  63.05,17.16 0 top
TP13  TEST_POINT  [TP-1MMX1MM]  62.92,8.28 0 bottom
TVS1  TVS2200  [TVS2200]  12.49,62.12 270 bottom
TVS2  TVS2200  [TVS2200]  51.48,10.69 90 bottom
TX_LED  Amber  [LED-805]  26.4,3.51 270 top
U1  TPD6S300  [TPD6S300]  15.52,57.47 180 top
U2  TPD6S300  [TPD6S300]  41.71,4.21 90 top
U3  DS2431P  [TSOC6]  11.8,43.08 0 top
U4  CH7053A  [QFN40P1000X1000X90_HS-89M]  25.66,42.95 180 top
U5  LP5907MFX  [SOT23-5]  13.31,21.7 270 top
U6  MP28167GQ  [MP28167GQ]  58.1,39.82 180 top
U7  PCM1803SMD  [SSOP20]  22.71,10.5 180 top
U8  TPS65988  [TPS65988]  56.36,15.67 270 top
U9  W25X05CLSNIG  [W25X05CLSNIG]  32.77,26 270 top
U10  ENC424J600  [TQFP44]  55.77,40.16 90 bottom
UN0  FT230XS  [SSOP-16]  33.16,5.61 0 top
Y1  ABM3B  [ABM3B]  17.42,30.74 270 top
Y2  24.576MHz OSCILLATOR  [CRYSTAL-SMD-7.5X5.2-6PIN]  15.09,4.15 0 top

## Tracks (layer width: path | path; a pad name or v marks a point on that pad's centre or on a via)
1WIRE
  Top 0.254: U3.2 11.78,41.47 | J1.58 3.85,31.14 5.1,32.4 9.45,32.4 10.17,33.12 11.05,33.12 12.66,34.72 R12.1
  Top 0.406: 11.78,41.47 11.78,40.1 11.45,39.77 11.45,38.52 11.45,38.51 11.45,37.88 12.66,36.67 R12.1
5V_SYS  (via drill 0.3 pad 0.61, 0.35)
  Top 0.127: C78.2 53.4,38.68
  Top 0.305: UN0.12 33.47,8.39 33.47,9.56 33.18,9.85 C61.1 33.18,11.18 32.48,11.88 31.41,11.88 30.32,12.97 v30.28,12.97
  Top 0.813: J1.41 7.76,10.86 v7.76,11.96
  other vias: 6.78,11.99 8.7,12 51.44,37.92 53.22,37.92 52.33,37.29 54.24,37.41
  pour SIG2: 5.08,10.79 5.08,13.34 0.13,13.34 0.13,23.34 22.75,23.47 37.57,38.5 60.82,38.5 60.82,25.15 46.67,25.15 29.47,11.18 9.16,11.18 9.16,11.17 5.46,11.18
  pour Top (no thermals): 6.28,10 6.28,12.49 9.11,12.49 9.11,10
  pour Top (no thermals): 57.1,39.25 49.24,39.25 49.24,35.26 52.8,35.26 55.55,35.21 55.55,38.2 57.1,38.2
ACTIVITY  (via drill 0.35)
  Top 0.203: v46.95,55.65 49.05,53.55 49.05,51.82 49.05,43.8 46.5,41.25 v46.5,40.55
  Bottom 0.203: J2.9 60.23,69.05 50.25,69.05 45.8,64.6 45.8,56.8 v46.95,55.65 | v46.5,40.55 R27.2
ADCIN1
  Top 0.152: U8.6 56.95,19.03 56.95,19.41 56.72,19.64 56.72,20.11 56.99,20.38 57.26,20.38 57.45,20.57 57.45,21.28 R4.1 | R4.1
  Top 0.203: R5.2 R4.1
ADCIN2
  Top 0.152: U8.10 55.36,20.13 55.17,20.32 55.17,21.31 55.75,21.89 R7.1
  Top 0.203: R7.1 55.74,21.93 R10.2
ANT_SELECT
  Top 0.152: U8.49 60.11,15.47 60.26,15.32 61.2,15.32 TP12.0
AUDIO_EN
  Top 0.152: U8.48 60.06,15.07 60.14,14.99 61.34,14.99 62.23,15.88 TP11.0
AVCC  (via drill 0.3 pad 0.61)
  Top 0.305: U7.14 21.73,5.82 v21.46,5.55
  Top 0.406: Y2.4 arc90 12.6,6.3
  Top 0.508: Y2.4 12.6,6.3 | Y2.1 12.61,2.11 12.61,6.19 Y2.4 | v12.6,3.91 12.55,3.86 Y2.4
  Bottom 0.508: C69.1 21.56,5.65 v21.46,5.55
  other vias: 13.27,15.06 11.29,15.03 12.35,14.31
  pour SIG1 (isolate 0.305): 10.13,15.78 10.13,0.59 22.77,0.59 22.77,9.47 16.86,9.47 16.86,15.78
  pour Top (no thermals): 11.02,15.53 14.54,15.53 14.54,0.62 10.79,0.62 10.79,15.52 10.79,15.52 11.01,15.52
  pour Bottom (no thermals): 13.76,15.45 10.96,15.45 10.96,12.34 13.76,12.34
AVDD  (via drill 0.3 pad 0.61)
  Top 0.152: U4.60 U4.61
  Top 0.203: C18.1 30.51,49.4 29.86,48.75 U4.23 | U4.53 18.79,43.95 18.31,44.43 C20.1 | C21.1 18.19,39.8 19.14,40.75 U4.61 | U4.41 22.66,51.35 C25.1 | U4.30 27.06,49.85 27.41,50.2 C24.1 | U4.9 32.67,41.95 34.18,40.44 C17.1 | U4.46 19.7,46.75 17.53,48.92 | U4.73 23.86,36.7 24.62,35.94 C35.1 | U4.77 25.46,36.7 27.32,34.84 C34.1 | U4.83 27.86,37.3 27.97,37.19 27.97,36.69 29.13,35.53 29.73,35.53 29.98,35.28 29.98,34.78 C37.1 | C25.1 | U4.23 | C35.1 | C19.1 | C19.1 | v17.71,40.5
  Top 0.254: v17.71,40.5 17.11,40.5 16.71,40.9 16.71,43.6 17.1,44 17.32,44.22 C20.1 | C25.1 21.81,52.6 21.31,53.1 19,53.1 18.2,52.3 18.2,51.3 17.31,50.41 v17.31,49.9 17.28,49.72 | C24.1 27.35,50.95 27.35,51.5 27.78,51.92 30.44,51.92
  Top 0.305: C18.1 30.53,50.92 v30.53,52.01 30.44,51.92 | v24.62,32.54 25.37,31.79 26.32,31.79 27.32,32.79 C34.1 | C34.1
  Top 0.508: L2.1 14.25,26.55 | 14.25,26.55 arc90 14.25,26.55 | 14.25,26.55 v14.25,26.65
  Top 0.635: 17.28,49.72 17.53,49.48 17.53,48.92 C19.1 | C21.1 17.61,40.4 v17.71,40.5 17.51,40.7 C22.1 | v34.23,39.69 34.23,40.34 C17.1 | v34.23,39.69 R15.2 | v30.02,32.31 29.87,32.46 C38.1 29.87,34.59 C37.1 | v24.62,32.54 C36.1 | C36.1 | v24.62,32.54 C35.1 | C35.1 | v24.62,32.54 23.54,31.46 23.39,31.46 R20.2 R21.2 | L2.1 14.24,25.66 C28.1 C23.1 | v34.23,39.69
  pour SIG2: 12.5,23.96 12.5,50 18.67,56.17 34.76,56.17 34.95,55.98 34.95,36.38 22.52,23.94 18.89,23.95
BPAS  (via drill 0.35)
  Top 0.203: U7.8 21.09,14.98 20.83,15.24 18.29,15.24 17.97,15.56 R38.2 18.8,17.07 18.8,18.8 19.27,19.27 27.2,19.27 29.46,21.54 29.46,28.09 30.07,28.7 v30.07,29.2
  Top 0.254: J1.36 39.6,54.01 40.59,55 45.84,55 46.48,54.36 v46.48,53.34
  Bottom 0.203: v30.07,29.2 40.76,29.2 42.32,30.76 42.32,36.89 42.82,37.39 42.82,48.82 45.97,51.97 45.97,52.83 v46.48,53.34
CCT  (via drill 0.35)
  Top 0.203: v50.34,50 50.34,46.81 52.2,44.96 56.13,44.96 56.57,45.39 60.37,45.39 61.85,46.87 v61.85,51.05
  Bottom 0.203: R41.1 61.11,49.97 R3.2 R6.2 | R41.1 | v61.85,51.05 61.85,50.67 R41.1 | L7.2 49.11,50 v50.34,50
DGND  (via drill 0.3 pad 0.61)
  Top 0.254: U7.9 20.43,13.31 v19.97,12.84
  Top 0.305: U7.13 21.09,9.27 v20.95,9.4
  Top 0.508: Y2.2 19.01,2.05 v19.03,2.07
  Bottom 0.254: SJ3.2 21.44,10.12 20.95,9.63 v20.95,9.4
  Bottom 0.8: SJ3.2 21.24,10.5 20.95,10.21 v20.95,9.4
  other vias: 9.91,11.48 15.6,4.02 9.91,14.65 10.32,2.83 21.02,3.1 10.02,7.72 17.8,4.02
  pour GND (isolate 0.305): 20.99,15.36 8.86,15.36 8.86,0.59 21.69,0.59 21.69,14.66
  pour Bottom (isolate 0.305, rank 2, no thermals): 21.89,0.59 21.89,12.1 20.47,13.46 13.7,13.46 13.7,15.33 9.1,15.33 9.1,0.59
  pour Top (rank 2, no thermals): 9.7,0.5 9.7,15.4 14.8,15.4 14.8,10.4 22.48,10.4 22.48,5.1 21.4,5.1 21.4,0.5
DRAIN1  (via drill 0.2 pad 0.61)
  Top 0.152: U8.58 54.45,17.54 v54.05,17.95
  Top 0.2: U8.19 53.66,16.67 v54.05,17.06 | U8.8 56.16,18.41 55.71,17.96 v54.89,17.96
  other vias: 55.75,17.06 55.73,17.96 54.9,17.06
  pour Top (no thermals): 52.92,18.4 56.2,18.4 56.2,16.65 53.7,16.65 53.7,18.15 51.37,18.15 51.38,19.43 51.38,19.53 51.73,19.53
  pour Bottom: 53.7,18.4 56.1,18.4 56.1,16.7 53.6,16.7 53.6,18.4
DRAIN2  (via drill 0.2 pad 0.61)
  Top 0.2: U8.52 58.24,16.67 v57.83,17.08 | U8.7 56.56,18.39 v56.97,17.98
  other vias: 56.98,17.06 57.81,17.99 58.67,18 58.68,17.07
  pour Top (no thermals): 56.5,18.35 59.73,18.35 60.97,19.59 61.55,19.59 61.55,18.15 59.1,18.15 59.1,16.65 56.5,16.65
  pour Bottom: 59,18.4 59,16.7 56.5,16.7 56.5,18.4
DSFGDF  (via drill 0.35)
  Top 0.241: v55.73,47.19 55.56,47.02 55.56,46.01 55.04,45.49 54.21,45.49 53.71,45.99 53.71,50.12 55.13,51.54 55.13,53.51 56.43,54.81 56.43,61.2 56.26,61.37 v56.24,61.37
  Bottom 0.241: U10.P17 55.77,47.15 v55.73,47.19 55.73,47.24 55.53,47.44 55.53,47.69 R1.1 | C92.1 56.39,60.59 56.39,61.22 v56.24,61.37
DSGDFSG  (via drill 0.35)
  Top 0.241: v55.02,47.19 55.16,47.05 55.16,46.17 54.9,45.91 54.46,45.91 54.1,46.27 54.1,49.96 55.52,51.38 55.52,53.3 56.83,54.61 56.83,59.33 57.1,59.6 57.6,59.6 57.8,59.8 57.8,60.21 57.6,60.41 57.02,60.41 56.82,60.61 56.82,61.19 56.95,61.32 v56.95,61.37
  Bottom 0.241: U10.P16 54.97,47.14 v55.02,47.19 55.02,47.24 55.1,47.32 55.1,47.63 R2.1 | C93.1 57.54,59.9 56.8,60.63 56.8,61.22 v56.95,61.37
DVDD  (via drill 0.3 pad 0.61)
  Top 0.203: 21.86,49 U4.43 | 21.86,49 22.26,48.6 U4.42 | U4.10 33.03,42.34 33.43,41.94 33.83,41.94 | U4.71 23.06,36.38 22.86,36.18 22.86,35.2 C32.1 | 21.86,49 21.86,50.25 C30.1 | 33.83,41.94 | 33.83,41.94 C29.1 | U4.42
  Top 0.635: C30.1 v21.81,51.18 | v21.81,51.18 | v34.21,42.79 34.23,42.77 C29.1 | v23.31,32.6 C33.1 23.31,34.73 C32.1
  Bottom 0.508: v19.24,23.54 19.27,23.56 TP1.0 20.03,23.87 v20.03,24.38
  other vias: 19.24,24.39
  pour PWR (isolate 0.152): 17.65,22.92 22.35,22.92 22.35,32 35.02,32 34.83,56.8 17.65,56.8
  pour Top (no thermals): 18.71,22.1 18.71,24.98 19.98,24.98 20.83,24.98 20.83,23.85 20.83,20.6 18.78,20.6 18.71,20.6 18.71,22.11
ETH-CS  (via drill 0.35)
  Top 0.203: v47.8,48.9 47.79,48.89 45.78,48.89 44.7,47.8 41.6,47.8 40.55,46.74
  Top 0.254: J1.28 39.95,43.84 40.55,44.44 40.55,46.74
  SIG1 0.203: v47.8,48.9 48.66,48.04 48.66,45 49.41,44.25 54.85,44.25 v55.65,43.44
  Bottom 0.203: U10.P34 59.77,36.87 56.26,40.39 56.26,43.31 56.13,43.44 v55.65,43.44
ETH-INT  (via drill 0.35)
  Top 0.305: J1.24 39.42,38.77 40.52,37.67 44.72,37.67 49.59,42.54 49.59,43.63 v50.99,45.03
  Bottom 0.203: U10.P24 63.29,43.37 R42.2
  Bottom 0.305: R42.2 63.25,43.55 63.25,44.25 62.7,44.8 51.22,44.8 v50.99,45.03
ETH-MISO  (via drill 0.35)
  Top 0.203: v47.6,47.9 47.58,47.88 46.63,47.88 45.13,46.38 J1.29
  SIG1 0.203: v47.6,47.9 48.02,47.48 48.31,47.2 48.31,44.65 49.06,43.89 54.27,43.89 v54.88,43.29
  Bottom 0.203: U10.P35 58.97,35.82 58.52,36.27 arc-90 58.52,36.68 58.59,36.75 arc90 58.59,37.17 58.49,37.27 arc90 58.08,37.27 57.52,36.72 arc-90 57.11,36.72 57.01,36.82 arc-90 57.01,37.23 57.56,37.78 arc90 57.56,38.2 57.46,38.3 arc90 57.05,38.3 56.49,37.74 arc-90 56.08,37.74 55.98,37.84 arc-90 55.98,38.26 56.53,38.81 arc90 56.53,39.22 56.43,39.33 arc90 56.02,39.33 55.47,38.77 arc-90 55.05,38.77 54.95,38.87 arc-90 54.95,39.29 55.51,39.84 arc90 55.51,40.25 55.4,40.35 arc90 54.99,40.35 54.64,40.01 53.85,40.01 53.47,40.39 53.47,41.66 53.85,42.04 54.48,42.04 54.99,42.04 55.12,42.16 55.12,43.05 v54.88,43.29
ETH-MOSI  (via drill 0.35)
  Top 0.203: v46.95,50.3 46.7,50.55 46.48,50.55
  Top 0.254: 46.48,50.55 41.18,50.55 40.26,49.63 40.26,47.33 39.32,46.38 J1.30
  SIG1 0.203: v46.95,50.3 46.95,48.75 46.95,47.8 47.95,46.8 47.95,44.5 49.31,43.14 v53.95,43.14
  Bottom 0.203: U10.P36 58.05,34.59 58.05,35.23 53.09,40.19 53.09,42.27 v53.95,43.14
ETH-SCK  (via drill 0.35)
  Top 0.203: v47.35,46.6 47.35,44.35 46.84,43.84 44.23,43.84
  Top 0.254: 44.23,43.84 J1.27
  SIG1 0.203: v47.35,46.6 47.35,43.9 48.64,42.61 v52.5,42.61
  Bottom 0.203: v52.5,42.61 52.5,43.23 53.24,43.97 56.26,43.97 57.02,43.21 57.02,41.27 58.04,40.26 arc90 58.45,40.26 58.47,40.28 arc-90 58.89,40.28 58.89,40.28 arc-90 58.89,39.86 58.43,39.41 arc90 58.43,38.99 58.44,38.99 arc90 58.85,38.99 59.31,39.45 arc-90 59.72,39.45 59.73,39.44 arc-90 59.73,39.03 59.7,39.01 arc90 59.7,38.59 60.33,37.97 60.33,33.27 R44.2
FAULT1  (via drill 0.3 pad 0.61)
  Top 0.152: U1.9 12.83,57.07 R28.1 11.95,57.95 v11.95,58.64 | U8.22 52.42,15.47 50.95,16.94 48.38,16.94 47.63,17.7 47.63,21.96 v49.75,24.09
  SIG1 0.152: v41.45,42.64 42.86,41.23 42.86,35.44 46.59,31.71 46.59,26.37 48.35,24.61 49.24,24.61 v49.75,24.09
  Bottom 0.152: v41.45,42.64 41.25,42.84 41.25,53.8 34.12,60.92 16.99,60.92 16.92,60.99 14.3,60.99 v11.95,58.64
FAULT2  (via drill 0.3 pad 0.61)
  Top 0.152: U2.9 41.31,6.65 41.86,7.2 v41.86,9.6 v41.85,9.61 | U8.23 51.94,15.07 50.62,16.38 49.43,16.38 48.98,15.94 v48.5,15.94
  SIG2 0.152: v48.5,15.94 48.19,15.94 41.86,9.61 v41.85,9.61
  Bottom 0.254: R29.1 41.6,6.53 41.85,6.77 v41.85,9.61
FEL  (via drill 0.3 pad 0.61, 0.35)
  Top 0.203: v40.01,18.67 39.78,18.45 J1.8 | v63.5,21.46 64.98,21.46 S1.1
  Bottom 0.203: v63.5,21.46 63.5,23.43 61.15,25.78 44.32,25.78 41.06,22.52 41.06,19.72 v40.01,18.67
FMT0  (via drill 0.3 pad 0.61)
  Top 0.254: U7.17 23.68,8.1 v23.28,8.51
  Bottom 0.254: JP2.2 24.8,10.03 v23.28,8.51
FMT1  (via drill 0.3 pad 0.61)
  Top 0.254: U7.18 24.34,7.87 24.34,8.3 v24.59,8.56
  Bottom 0.254: JP1.2 28.05,9.47 27.14,8.56 v24.59,8.56
GND  (via drill 0.2 pad 0.41, 0.2 pad 0.61, 0.3 pad 0.41, 0.3 pad 0.61, 0.35, 0.35 pad 0.61, 3 pad 6)
  Top 0.152: U8.59 55.45,14.62 54.18,14.62 v54.15,14.65 | U1.8 U1.21 U1.18 U1.17 U1.16 | 41.71,4.43 U2.21 | 41.11,4.21 U2.21 | 41.71,3.93 U2.21 | v15.06,56.93 15.52,56.47 U1.13
  Top 0.2: U8.20 53.63,16.27 55.28,14.62 55.45,14.62 | U8.51 59.07,16.27 57.5,14.7 v57.5,14.65
  Top 0.203: 20.98,47.9 20.99,47.89 21.45,47.89 U4.44 21.46,47.15 21.61,47 23.71,47 23.86,47.15 U4.38 | 20.98,47.9 20.41,48.47 C30.2 | U4.22 30.61,48.9 31.91,50.2 C18.2 | 18.39,47.44 19.48,46.35 U4.47 | C20.2 17.53,45.83 19.01,44.35 U4.52 | U4.62 19.44,40.35 18.38,39.28 18.38,38.87 17.91,38.4 C21.2 | U4.33 25.86,47.15 26.01,47 27.31,47 27.46,47.15 U4.29 27.46,49.55 C24.2 | U4.28 27.86,45.15 U4.17 U4.18 28.26,45.55 | U4.70 22.66,36.58 21.92,35.84 C32.2 | 24.66,37.91 24.66,36.7 26.02,35.34 C35.2 | U4.79 26.26,36.52 27.28,35.5 27.96,35.5 C34.2 | U4.27 28.26,45.55 | C34.2 | C35.2 | C32.2 | C26.1 | C26.1 18.82,32.94 Y1.4 | U4.75 24.66,37.91 | 24.66,37.91 | U4.59 22.66,41.55 | U4.11 28.76,42.75 | U4.6 28.96,40.75 U4.P$13 | U4.5 28.36,40.35 | U4.P$3 U4.89 28.26,45.55 | U4.45 20.71,47.63 20.98,47.9 | U2.13 41.11,4.21 | 41.71,3.93 U2.18 U2.17 U2.16 | U2.8 41.71,4.43 | 22.23,16.61 C50.2 | U6.2 60.17,39.57 60.35,39.75
  Top 0.254: 35.58,39.19 35.63,39.14 C6.1 | U4.P$1 28.36,40.2 28.36,40.35 | 22.66,41.55 U4.P$17 | 28.76,42.75 U4.P$14 | J8.2 24.75,64.17 v24.6,64.32 | J8.5 26.25,64.17 v26.11,64.32 | J8.8 27.75,64.14 v27.57,64.33 | J8.11 29.25,64.05 v28.97,64.33 | J3.A1 15.29,65.59 15.54,65.84 J3.B12 16.36,66.56 J3.SHIELD4 | J3.A12 9.78,65.63 10.04,65.89 J3.B1 8.97,66.56 J3.SHIELD5 | J4.B12 47.25,6.1 J4.SHIELD4 | J4.B1 54.64,6.1 J4.SHIELD5 | R10.1 55.54,23.78 55.04,23.28 v54.95,23.28 | UN0.13 32.84,9.16 C61.2 | R23.1 50.5,22.47 v50.48,22.49 | 18.39,47.44 C19.2 16.13,48.84 R16.2 | U4.47 22.26,46.35 U4.P$4 | J8.17 32.25,63.68 31.58,64.35 v30.11,64.35
  Top 0.27: J4.B1 53.57,6.82 53.82,7.07 J4.A12 | J4.B12 48.07,6.79 48.32,7.04 J4.A1
  Top 0.305: v15.26,48.15 15.11,48 15.11,46.6 15.96,45.75 R17.2 | UN0.5 33.48,3.94 v33.91,4.37 | U7.6 22.39,14.95 22.23,15.11 22.23,16.61
  Top 0.406: C67.1 29.36,14 29.93,14.57 v29.98,14.57 | C49.2 21.34,18.02 v21.34,16.64 | C52.2 26.09,16.76 v26.8,16.76 26.8,17.61 C51.2 | U9.4 v30.86,30.73 | J1.22 39.58,36.23 v39.62,36.27 | J1.21 41.25,36.23 v41.08,36.06 | C53.1 34.67,19.05 34.29,18.67 v34.16,18.67 | R36.2 v27.69,5.21
  Top 0.508: C40.2 10.61,21.7 U5.2 | v32.07,51.93 32.07,51.06 C18.2 | D1.2 22.71,55.54 v22.72,55.55 | D2.2 v27.21,55.53 v27.21,55.54 | C75.1 v10.94,59.38 | v15.51,63.67 C74.1 | C62.2 v37.93,1.99 | C10.2 44.64,9.54 v44.63,9.52 | R38.1 17.97,18.47 v18.04,18.54 | C66.1 29.2,15.43 v29.87,15.43 | R45.1 v30.54,10.63 v30.55,10.62 31.38,10.62 C61.2 | J1.2 36.76,10.82 36.19,11.4 C60.2 | R26.2 59.44,44.6 C71.1 57.74,44.66 57.71,44.66 57.26,44.21 v56.8,44.21 | R5.1 57.91,23.77 v57.93,23.75 | C41.2 v50.24,29.86 v50.25,29.85 | C42.2 51.68,29.92 v51.7,29.9 | J1.51 7.71,23.61 v7.71,24.57
  Top 0.635: v29.56,51.17 29.08,51.17 C24.2 | C39.2 v16.91,21.1 17.71,21.1 C31.2 | v19.33,52.2 C25.2 | C25.2 | C30.2 C25.2 | R17.2 17.25,45.75 C20.2 | v17.48,43.41 17.48,42.62 C22.2 | C21.2 v17.61,37.7 | C29.2 35.63,41.19 v35.68,41.14 35.58,41.04 C17.2 35.58,39.19 | v31.41,32.3 31.27,32.44 C38.2 31.27,34.59 C37.2 | v28.72,33.69 | v28.72,33.69 C34.2 | C36.2 v26.02,32.54 C35.2 | C36.2 | C35.2 | v21.91,32.6 C33.2 21.91,34.73 C32.2 | C40.2 10.33,21.6 8.1,23.83 J1.51 7.82,23.5 8.74,23.5 9.5,24.26 C23.2 C28.2
  Top 1.016: J8.23 36,61.1 v36.2,60.91
  GND 0.305: J8.21 22.88,68.91 | 22.88,68.91 | J8.21 20.09,68.91 20.08,68.9 | J8.21 21.5,70.98 | J8.21 21.5,66.94 | J8.22 20.11,62.95 20.1,62.94 | J8.22 21.5,65.09 | J8.23 37.23,62.95 37.26,62.92 | J8.23 35.97,62.92 34.73,62.92 | J8.23 36,64.91 36.03,64.94 | J8.23 36,61.1 | J8.20 37.4,68.91 37.41,68.9 | J8.20 34.73,68.91 | 34.73,68.91 | J8.20 36,70.82 35.98,70.84 | J8.20 36,66.92 | J8.22 22.9,62.95 22.91,62.96
  SIG1 0.305: J8.21 22.88,68.91 | 22.88,68.91 | J8.21 20.13,68.91 20.12,68.9 | J8.21 21.5,70.98 | J8.21 21.5,66.94 | J8.20 36,70.82 35.99,70.83 | J8.20 37.39,68.91 37.41,68.89 | J8.20 34.75,68.91 34.74,68.9 | J8.20 36,66.94 | J8.23 36,64.88 35.99,64.89 | J8.23 37.22,62.95 37.23,62.94 | J8.23 34.7,62.95 | 34.7,62.95 | J8.23 36,61.1 v36.2,60.91 | J8.22 22.87,62.95 22.88,62.96 | J8.22 21.5,65.08 | J8.22 20.13,62.95 20.12,62.94
  SIG2 0.305: J8.21 22.88,68.91 | 22.88,68.91 | J8.21 20.11,68.91 20.09,68.89 | J8.21 21.5,66.94 | J8.21 21.5,70.98 | J8.22 21.5,65.09 | J8.22 22.89,62.95 | 22.89,62.95 | J8.22 20.13,62.95 20.12,62.94 | J8.23 35.98,62.93 34.73,62.93 | J8.23 37.23,62.95 | 37.23,62.95 | J8.23 36,61.1 | J8.23 36,64.88 35.99,64.89 | J8.20 36,66.94 | J8.20 37.4,68.91 37.41,68.9 | J8.20 34.74,68.91 | 34.74,68.91 | J8.20 36,70.82 35.99,70.83
  Bottom 0.203: Q5.2 45.49,35.11 v45.44,35.16 | U10.P42 53.37,35.55 v53.42,35.6 | C86.2 62.68,50.98 v62.61,51.05
  Bottom 0.254: 46.83,6.53 J4.SHIELD4 | TVS1.5 TVS1.6 v11.84,60.56 v11.85,60.55 | TVS1.5 TVS1.4 13.14,60.67 v13.11,60.64 | TVS1.5 TVS1.7 | TVS2.4 TVS2.5 | TVS2.5 TVS2.6 | TVS2.5 TVS2.7 | C3.1 54.21,7.7 v54.32,7.8
  Bottom 0.305: J3.SHIELD5 8.65,66.29 8.21,65.84 | J3.SHIELD0 16.66,65.99 J3.SHIELD4 | J3.SHIELD4 | J3.SHIELD4 17.03,66.62 17.03,70.68 J3.SHIELD3 | C15.2 52.19,24.06 v52.14,24.11 | J8.21 20.08,68.91 | 20.08,68.91 | J8.21 22.86,68.91 22.88,68.89 | J8.21 21.5,70.99 | J8.21 21.5,66.94 | J8.22 21.5,65.1 | J8.22 22.89,62.95 22.9,62.96 | J8.22 20.12,62.95 20.11,62.94 | J8.20 36,70.87 36.01,70.88 | J8.20 34.79,68.91 | 34.79,68.91 | J8.20 36.04,68.95 37.17,68.95 | J8.20 36,66.97 | J8.23 36,64.82 36.01,64.83 | J8.23 37.27,62.95 | 37.27,62.95 | J8.23 36,61.23 | J8.23 34.89,62.95 | 34.89,62.95 | C56.C 12.28,17.43 v13.33,16.37 | v59.05,51.4 58.95,51.3 C87.2
  Bottom 0.406: C46.1 49.06,17.77 v48.65,17.77 | v21.34,16.64 21.59,16.89 C55.1
  Bottom 0.508: J4.SHIELD3 45.86,2.71 45.86,5.56 46.83,6.53 46.83,6.8 J4.SHIELD0 | J4.SHIELD2 55.34,1.95 55.55,2.17 55.55,6.13 55.28,6.4 J4.SHIELD5 55.26,6.73 J4.SHIELD1 54.57,7.7 C3.1 | C2.1 9.06,64.99 8.21,65.84 | C45.1 49.73,10.68 v49.72,10.67 | C76.1 40.62,9.97 v40.6,9.98 | C9.1 54.92,16.07 v55.27,15.72 | C14.1 54.08,23.28 v54.95,23.28 55.19,23.28 C5.1 55.78,22.69 C12.1 | C13.1 v62.5,21.51 | C16.2 61.44,21.92 v61.46,21.9 | C54.1 68.1,14.3 R24.1 68.25,14.13 v68.25,13.34 | C4.1 48.49,7.88 v47.73,8.63 v47.73,8.64 | JP2.1 25.61,12.12 v25.6,12.13 | JP1.3 28.86,9.16 v28.13,8.43 | v52.6,47.15 52.57,47.12 U10.P13 U10.P14 | U10.P19 57.35,45.89 v57.35,47.2 | U10.P22 60.09,45.55 v61.4,45.55 | R37.2 46.52,46.62 v46.55,46.65 | C83.2 46.22,38.75 46.19,38.95 45.85,39.35 v45.85,39.95 | C90.2 45.58,36.87 v45.55,36.9 | C91.2 C85.2 51.27,51.1 v51.19,51.1 | C1.1 15.65,64.93
  Bottom 0.8: SJ3.1 22.86,10.5 22.89,10.47 v22.89,9.58
  other vias: 38.58,9.61 37.25,9.62 19.4,26.21 43.69,62.01 31.72,55.55 16.32,35.54 14.92,33.84 14.92,31.74 14.92,29.64 14.97,27.74 15.27,25.54 18.17,25.54 19.92,27.74 20.32,29.64 20.32,31.74 20.32,33.84 37.59,60.91 38.99,60.91 43.09,60.71 44.49,60.71 16.72,25.49 2.09,60.68 3.49,60.68 3.19,57.83 5.49,13.98 7.14,14.63 4.5,67 68,5.5 4.5,5.5 68,67 4.97,36.19 4.92,51.44 9.62,35.14 27.98,32.07 55.25,14.65 56.35,14.65 58.5,14.64 55.25,13.5 56.35,13.5 57.5,13.5 57.54,15.72 56.37,15.71 41.23,3.72 42.16,3.73 42.14,4.63 41.23,4.66 51.08,10.66 51.92,10.65 12.07,62.12 12.91,62.11 51.93,12.26 51.15,12.26 15.06,57.93 15.96,57.94 15.93,56.95 40.33,2.69 40.35,1.89 58,1 62,1 66,1 70,1 71.5,12 71.5,17 71.5,19 71.5,24 71.5,28 71.5,32 71.5,36 71.5,40 71.5,44 71.5,48 71.5,52 71.5,56 71.5,60 71.5,64 67,71 63,71 19,71 7,71 3,71 1,65 1,61 1,9 8,1 4,1 1,4 50.05,35.4 59.69,41.71 59.44,41.08 57.66,39.81 59,71 55,71 51,71 47,71 43,71 39,71 35,71 31,71 27,71 23,71
  pour Bottom (isolate 0.305, rank 4, no thermals): -0.02,71.06 -0.02,1.7 arc90 1.71,-0.04 70.8,-0.04 arc90 72.53,1.7 72.53,70.93 arc90 70.92,72.54 1.46,72.54 arc90
  pour Top (isolate 0.305, rank 3, no thermals): 72.57,1.61 72.57,70.91 arc90 71.06,72.41 1.29,72.41 arc90 -0.02,71.1 -0.02,1.44 arc90 1.42,0 9.36,0 9.36,15.68 15.1,15.68 15.1,10.71 22.78,10.71 22.78,4.75 21.8,4.75 21.8,-0.09 70.94,-0.03 arc90
  pour GND (isolate 0.4, rank 3): -0.02,71.06 -0.02,1.44 arc90 1.46,-0.04 70.94,-0.04 arc90 72.58,1.6 72.58,70.88 arc90 70.92,72.54 1.46,72.54 arc90
  pour Bottom (no thermals): 50.56,12.69 52.5,12.69 52.5,10.23 50.52,10.23 50.52,12.7
  pour Bottom: 11.04,61.37 13.93,61.37 13.93,59.81 11.04,59.81
  pour SIG2: 0.48,23.86 0.48,71.47 arc-90 1.56,72.55 71.05,72.55 arc-90 72.52,71.08 72.52,1.61 arc-90 70.9,-0.01 45.67,-0.01 45.67,7.83 47.12,9.27 66.42,9.27 66.42,38.86 35.49,38.99 35.49,56.2 34.96,56.73 18.42,56.73 11.84,50.46 11.81,23.74
  pour SIG1 (rank 3): 1.83,72.55 70.84,72.55 arc-90 72.51,70.89 72.51,1.31 arc-90 71.15,-0.04 1.47,-0.04 arc-90 -0.02,1.44 -0.02,70.7 arc-90
HOTPLUG_DET  (via drill 0.3 pad 0.61)
  Top 0.152: U4.51
  Top 0.203: v18.95,45.35 19.56,44.75 U4.51 | J8.19 33.25,58.79 32.66,58.2 D3.4
  Top 0.254: v32.61,49.3 33.51,50.2 33.51,57.2
  Top 0.305: 33.51,57.2 | 33.51,57.2 D3.4 | 33.51,57.2 34.46,57.2 R22.2
  Bottom 0.203: v32.61,49.3 31.81,49.3 30.81,48.31 21.71,48.31 18.95,45.55 v18.95,45.35
HPL
  Top 0.254: J1.3 43.38,13.34 44.08,13.34
  Top 0.508: C64.1 44.39,13.65 44.08,13.34
HPR
  Top 0.508: C65.1 J1.7
HRESET  (via drill 0.3 pad 0.61, 0.35)
  Top 0.152: U8.44 60.1,13.47 61.17,12.41 v64.36,12.41
  Top 0.254: J1.37 44.2,56.55 46.42,58.77 46.42,61.81 v47.27,62.66
  Bottom 0.203: v64.36,12.41 68.68,12.41 69.1,12.83 69.02,12.83 69.27,13.08 R24.2 69.27,15.16 C54.2 69.39,51.76 69.38,51.78 69.38,59.02 64.2,64.2 48.9,64.2 47.37,62.66 v47.27,62.66
I2C1_IRQZ  (via drill 0.3 pad 0.61)
  Top 0.152: U8.29 53.76,11.98 53.07,11.29 R34.1 53.02,10.56 52.04,11.54 51.01,11.54 46.5,16.05 v46.5,24.09
  Top 0.254: J1.23 41.31,38.77 v41.25,38.7
  SIG1 0.152: v41.25,38.7 41.71,38.24 41.71,35.12 44.75,32.08 44.75,25.75 44.98,25.53 | v46.5,24.09 46.41,24.09 44.98,25.53 | 44.98,25.53
I2C1_SCL  (via drill 0.3 pad 0.61)
  Top 0.152: U8.27 52.2,13.47 51.9,13.18 50.4,13.18 47.32,16.25 47.32,22.64 v48.73,24.05
  Top 0.254: v41.25,41.25 41.3,41.3 J1.25
  SIG1 0.152: v48.73,24.05 48.34,24.05 46.28,26.12 46.28,31.54 42.49,35.33 42.49,40.04 41.27,41.25 v41.25,41.25
I2C1_SDA  (via drill 0.3 pad 0.61)
  Top 0.152: U8.28 52.23,13.07 52.03,12.87 50.26,12.87 46.99,16.14 46.99,23.43 v47.59,24.03
  Top 0.254: J1.26 38.45,41.3 v39.53,40.22
  SIG1 0.152: v39.53,40.22 41.06,40.22 42.11,39.17 42.11,35.18 45.97,31.32 45.97,25.66 v47.59,24.03
I2C2_SCL
  Top 0.152: U8.32 54.96,11.87 55.42,11.41 R11.1
I2C2_SDA
  Top 0.152: R13.1 56.43,10.05 55.77,10.71 55.77,11.5 55.36,11.9 U8.33
I2S_CLK  (via drill 0.3 pad 0.61)
  Top 0.203: v21.75,42.25 21.45,41.95 U4.58
  Top 0.254: U7.11 19.79,8.21 v19.37,8.63
  SIG1 0.203: v21.75,42.25 21.75,41.82 19.87,39.94 17.47,39.94 15.89,41.52 15.28,41.52 14.55,40.8 14.55,37.85 10.85,34.15 10.85,24.58 13.14,22.29 17.97,22.29 20.6,19.66 20.6,9.98 19.37,8.75 v19.37,8.63
I2S_DOUT  (via drill 0.3 pad 0.61)
  Top 0.203: U4.56 19.61,42.75 19.37,42.51 v19.3,42.51 | U7.12 20.48,6.92
  Top 0.254: 20.48,6.92 20.48,8.83 v19.5,9.82
  SIG1 0.203: v19.3,42.51 19.16,42.65 15.25,42.65 13.75,41.15 13.75,38.25 9.95,34.45 9.95,24.39 12.76,21.58 15.13,21.58 17.48,19.23 17.48,11.96 19.5,9.94 v19.5,9.82
I2S_WS  (via drill 0.3 pad 0.61)
  Top 0.203: U4.57 20.13,42.35 18.94,41.16 v18.58,41.16 | U7.10 19.76,14.1 v18.7,14.1
  SIG1 0.203: v18.58,41.16 17.53,42.21 15.36,42.21 14.15,41 14.15,38.05 10.4,34.3 10.4,24.44 12.91,21.93 17.82,21.93 18.8,20.96 18.8,17.78 18.7,17.68 v18.7,14.1
LCD_CLK  (via drill 0.3 pad 0.61)
  Top 0.203: U4.82 27.46,37.2 27.61,37.05 v27.61,36.17 | J1.76 4,54.01 5.2,55.2 9.17,55.2 9.49,54.87 9.49,46.64 10.16,45.97 13.3,45.97 13.78,45.5 13.78,36.03 v13.81,36
  SIG1 0.203: v13.81,36 14.91,36 15.26,36.35 20.46,36.35 21.57,37.46 27.24,37.46 27.61,37.1 v27.61,36.17
LCD_D3  (via drill 0.3 pad 0.61)
  Top 0.203: v28.12,48.97 28.66,48.97 U4.26 | U4.26 | v7.8,34.9 v7.79,34.9
  Top 0.254: v7.79,34.9 J1.59
  Bottom 0.203: v28.12,48.97 21.38,48.97 7.8,35.39 v7.8,34.9
LCD_D4  (via drill 0.3 pad 0.61)
  Top 0.203: v29.36,49.2 29.06,48.9 U4.25 | J1.60
  Top 0.254: v2.1,34.95 J1.60
  Bottom 0.203: v29.36,49.2 29.35,49.2 28.91,49.63 21.34,49.63 6.66,34.95 v2.1,34.95
LCD_D5  (via drill 0.3 pad 0.61)
  Top 0.203: v33.58,48.39 32.88,48.39 31.24,46.75 U4.21 | J1.61
  Top 0.254: v7.8,37.5 J1.61
  Bottom 0.203: v33.58,48.39 33.58,49.48 33.01,50.05 20.35,50.05 v7.8,37.5
LCD_D6  (via drill 0.3 pad 0.61)
  Top 0.203: v33.03,47.59 32.78,47.59 31.54,46.35 U4.20
  Top 0.254: v2.1,37.5 2.08,37.48 J1.62
  Bottom 0.203: v33.03,47.59 34.05,47.59 34.31,47.85 34.31,49.5 33.31,50.5 19.5,50.5 6.5,37.5 v2.1,37.5
LCD_D7  (via drill 0.3 pad 0.61)
  Top 0.203: v33.73,46.89 32.68,46.89 31.74,45.95 U4.19 | J1.63
  Top 0.254: v7.8,40 J1.63
  Bottom 0.203: v33.73,46.89 34,46.89 34.76,47.65 34.76,51.34 32.83,53.26 21.76,53.26 8.5,40 v7.8,40
LCD_D10  (via drill 0.3 pad 0.61)
  Top 0.203: U4.16 31.34,44.75 32.73,46.14 v33.03,46.14 | U4.16 | J1.64
  Top 0.254: v2.1,40 J1.64
  Bottom 0.203: v33.03,46.14 33.09,46.2 34.01,46.2 35.21,47.4 35.21,51.42 32.99,53.63 19.88,53.63 6.25,40 v2.1,40
LCD_D11  (via drill 0.3 pad 0.61)
  Top 0.203: U4.15 31.54,44.35 32.63,45.44 v33.63,45.44 | v7.8,42.55 v7.79,42.55
  Top 0.254: v7.79,42.55 J1.65
  Bottom 0.203: v33.63,45.44 34,45.44 35.66,47.1 35.66,51.56 33.16,54.06 19.8,54.06 8.29,42.55 v7.8,42.55
LCD_D12  (via drill 0.3 pad 0.61)
  Top 0.203: U4.14 31.74,43.95 32.43,44.64 32.93,44.64 v33.03,44.74 | v33.03,44.74
  Top 0.254: v2.1,42.6 2.1,41.32 J1.66
  Bottom 0.203: v33.03,44.74 33.07,44.7 33.91,44.7 36.11,46.9 36.11,51.74 36.01,51.84 33.38,54.47 19.71,54.47 8.44,43.2 2.7,43.2 v2.1,42.6
LCD_D13  (via drill 0.3 pad 0.61)
  Top 0.203: v33.73,44.04 32.43,44.04 31.94,43.55 U4.13 | U4.13
  Top 0.254: v7.8,45.1 J1.67
  Bottom 0.203: v33.73,44.04 33.85,44.04 36.56,46.75 36.56,51.81 36.44,51.92 33.51,54.86 19.6,54.86 9.84,45.1 v7.8,45.1
LCD_D14  (via drill 0.3 pad 0.61)
  Top 0.203: U4.12 32.84,43.15 v33.03,43.34
  Top 0.254: v2.1,45.1 2.1,43.86 J1.68
  Bottom 0.203: v2.1,45.1 6.4,45.1 7.42,46.12 10.36,46.12 20.86,56.62 32.38,56.62 37.01,52 37.01,45.11 35.26,43.36 33.05,43.36 v33.03,43.34
LCD_D15  (via drill 0.3 pad 0.61)
  Top 0.203: v32.33,41.34 32.12,41.55 U4.8
  Top 0.254: v7.8,47.65 J1.69
  Bottom 0.203: v32.33,41.34 v32.34,41.35 33.96,41.35 37.46,44.85 37.46,52.15 32.57,57.04 20.77,57.04 11.38,47.65 v7.8,47.65
LCD_D18  (via drill 0.3 pad 0.61)
  Top 0.203: U4.4 v32.22,39.95
  Top 0.254: v2.1,47.65 2.1,46.4 J1.70
  Bottom 0.203: v32.22,39.95 33.16,39.95 33.21,40 37.91,44.7 37.91,52.3 32.73,57.48 20.71,57.48 11.9,48.67 7.47,48.67 6.45,47.65 v2.1,47.65
LCD_D19  (via drill 0.3 pad 0.61)
  Top 0.203: v32.73,39.14 32.08,39.14 31.67,39.55 U4.3
  Top 0.254: v7.8,50.2 J1.71
  Bottom 0.203: v32.73,39.14 32.81,39.07 32.81,39 34.4,39 38.36,42.96 38.36,52.45 32.91,57.9 20.63,57.9 12.93,50.2 v7.8,50.2
LCD_D20  (via drill 0.3 pad 0.61)
  Top 0.203: v32.48,38.24 32.33,38.24 31.42,39.15 U4.2
  Top 0.254: v2.1,50.2 2.1,48.94 J1.72
  Bottom 0.203: v2.1,50.2 6.6,50.2 7.55,51.15 13.37,51.15 20.55,58.34 33.07,58.34 38.77,52.64 38.77,42.87 34.14,38.24 v32.48,38.24
LCD_D21  (via drill 0.3 pad 0.61)
  Top 0.203: U4.1 31.03,38.75 32.44,37.34 v32.92,37.34
  Top 0.254: v7.8,52.7 7.8,51.49
  Top 0.508: J1.73 arc45 J1.73 7.8,51.49
  Bottom 0.203: v7.8,52.7 8.99,51.51 13.22,51.51 20.48,58.77 33.24,58.77 39.19,52.81 39.19,42.79 33.74,37.34 v32.92,37.34
LCD_D22  (via drill 0.3 pad 0.61)
  Top 0.203: U4.88 31.2,38 32.56,36.64 v33.92,36.64
  Top 0.254: v2.08,52.7 J1.74
  Bottom 0.203: v2.08,52.7 2.1,52.73 6.7,52.73 7.41,53.44 8.15,53.44 9.73,51.86 13.07,51.86 20.44,59.23 33.4,59.23 39.62,53.01 39.62,42.71 33.95,37.04 33.95,36.67 v33.92,36.64
LCD_D23  (via drill 0.3 pad 0.61)
  Top 0.203: U4.87 29.46,37.4 29.68,37.18 31.44,37.18 32.77,35.84 33.42,35.84 | 33.42,35.84 | 33.42,35.84 v34.52,35.84
  Top 0.254: v5.6,54.05 7.75,54.05 J1.75
  Bottom 0.203: v5.6,54.05 8.05,54.05 9.88,52.22 12.92,52.22 20.39,59.68 33.59,59.68 40.04,53.23 40.04,42.63 34.6,37.19 34.6,35.92 v34.52,35.84
LCD_DE  (via drill 0.3 pad 0.61)
  Top 0.203: v14.51,36.8 14.61,36.8 14.19,37.22 14.19,45.66 13.47,46.38 10.67,46.38 10.07,46.98 10.07,58.62 9.61,59.09 J1.79 | U4.84 28.26,37.41 28.33,37.34 28.33,36.93 29.31,35.94 30.11,35.94 30.39,35.67 v30.71,35.67
  SIG1 0.203: v14.51,36.8 20.31,36.8 21.47,37.96 28.81,37.96 30.71,36.06 v30.71,35.67
LCD_HSYNC  (via drill 0.3 pad 0.61)
  Top 0.203: U4.86 29.06,37.3 29.59,36.76 31.27,36.76 32.9,35.14 v33.82,35.14
  Top 0.254: v7.8,57.8 J1.77
  Bottom 0.203: v33.82,35.14 34.84,35.14 35.22,35.53 35.22,37.31 39.98,42.06 40.43,42.51 40.43,53.48 33.82,60.09 20.29,60.09 12.8,52.6 9.99,52.6 7.8,54.8 v7.8,57.8
LCD_VSYNC  (via drill 0.3 pad 0.61)
  Top 0.203: U4.85 28.66,37.5 28.7,37.45 28.7,37.16 | 28.7,37.16 28.7,37.13 29.48,36.35 31.1,36.35 33.23,34.22 v33.91,34.22 | 28.7,37.16
  Top 0.254: v1.98,57.8 1.98,56.65 J1.78
  Bottom 0.203: v33.91,34.22 34.62,34.22 35.58,35.17 35.58,37.16 40.23,41.81 40.84,42.42 40.84,53.72 34.05,60.51 20.2,60.51 12.65,52.96 10.14,52.96 8.5,54.6 8.5,59.06 7.05,60.51 4.69,60.51 v1.98,57.8
LDO_1V8  (via drill 0.3 pad 0.61)
  Top 0.203: U8.35 56.16,11.2 v56.38,10.98
  Bottom 0.508: C8.2 56.57,11.18 v56.38,10.98
LDO_3V3  (via drill 0.3 pad 0.61)
  Top 0.203: U2.10 40.91,6.89 40.5,7.3 39.65,7.3 v39.6,7.25 | U8.9 55.76,19.81 v56,20.05 | R28.2 12.41,56.67 U1.10
  Top 0.254: v10.94,55.56 v10.95,55.55 | R13.2 | R13.2 R11.2 55.3,9.05 55.03,8.79 54.34,8.79 v54.28,8.85 53.44,8.85 53.07,9.22 R34.2 | R33.2 33.51,21.15 33.95,21.59 C53.2
  Top 0.406: C53.2 v34.67,22.35 | C75.2 12.19,56.64 R28.2
  Top 0.508: U9.8 v34.67,22.35 | v56,20.05 56,20.66 R7.2 R4.2 | C75.2 v10.94,55.56 | R32.2 R31.2 33.36,30.94 v32.77,30.94 32.73,30.98 R30.2
  SIG1 0.508: v34.67,22.35 34.63,22.31 30.89,22.31 29.54,23.66 29.54,27.62 32.77,30.85 v32.77,30.94 34.9,30.94 40.86,24.98 40.86,23.89 42.55,22.2 47.82,22.2 48.93,23.31 53.62,23.31 56,20.92 v56,20.05
  Bottom 0.508: C5.2 55.74,20.31 v56,20.05 | R29.2 40.6,7.28 C76.2 40.58,7.25 v39.6,7.25
  other vias: 12.22,55.55
  pour PWR: 17.02,56.77 0,56.77 0,0.38 71.88,0.38 71.88,20.7 53.85,20.7 53.85,18.92 46.1,18.92 46.1,22.87 33.78,22.87 33.78,10.41 9.4,10.41 9.4,38.73 17.02,38.73
  pour Top (no thermals): 14.38,56.77 12.83,56.77 12.35,57.25 10.37,57.25 10.37,55.24 10.61,55.01 13.85,55.01 14.45,55.6 14.45,56.74 14.41,56.78
LED_A
  Bottom 0.203: U10.P10 48.85,43.37 R35.1
LED_B
  Bottom 0.203: U10.P9 48.81,42.56 R27.1
LINK  (via drill 0.35)
  Top 0.203: v47.7,50.65 48.65,49.7 48.65,44.6 47,42.95 v46.5,42.95